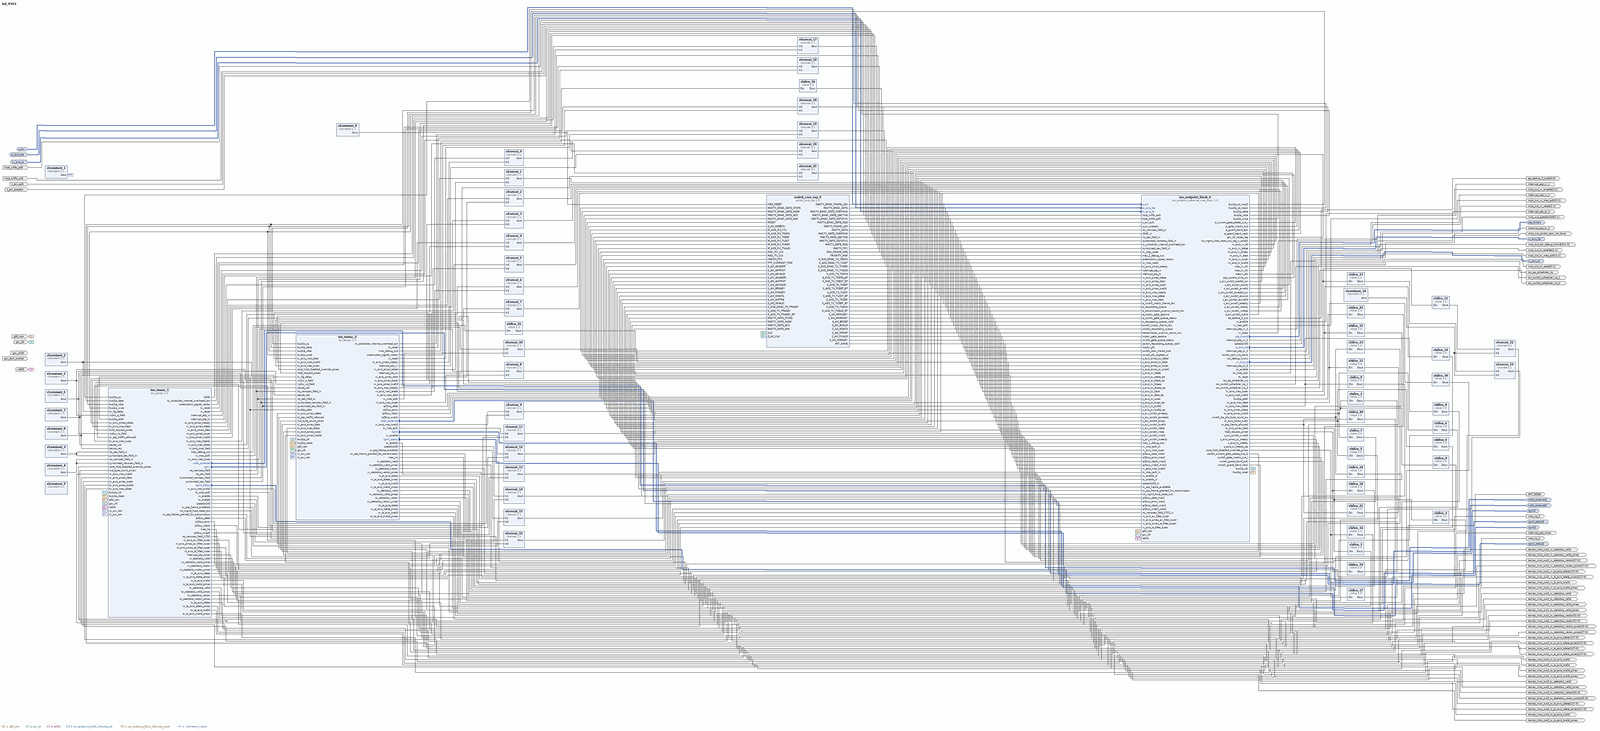
[diagram p0: block diagram of the top level, whole]
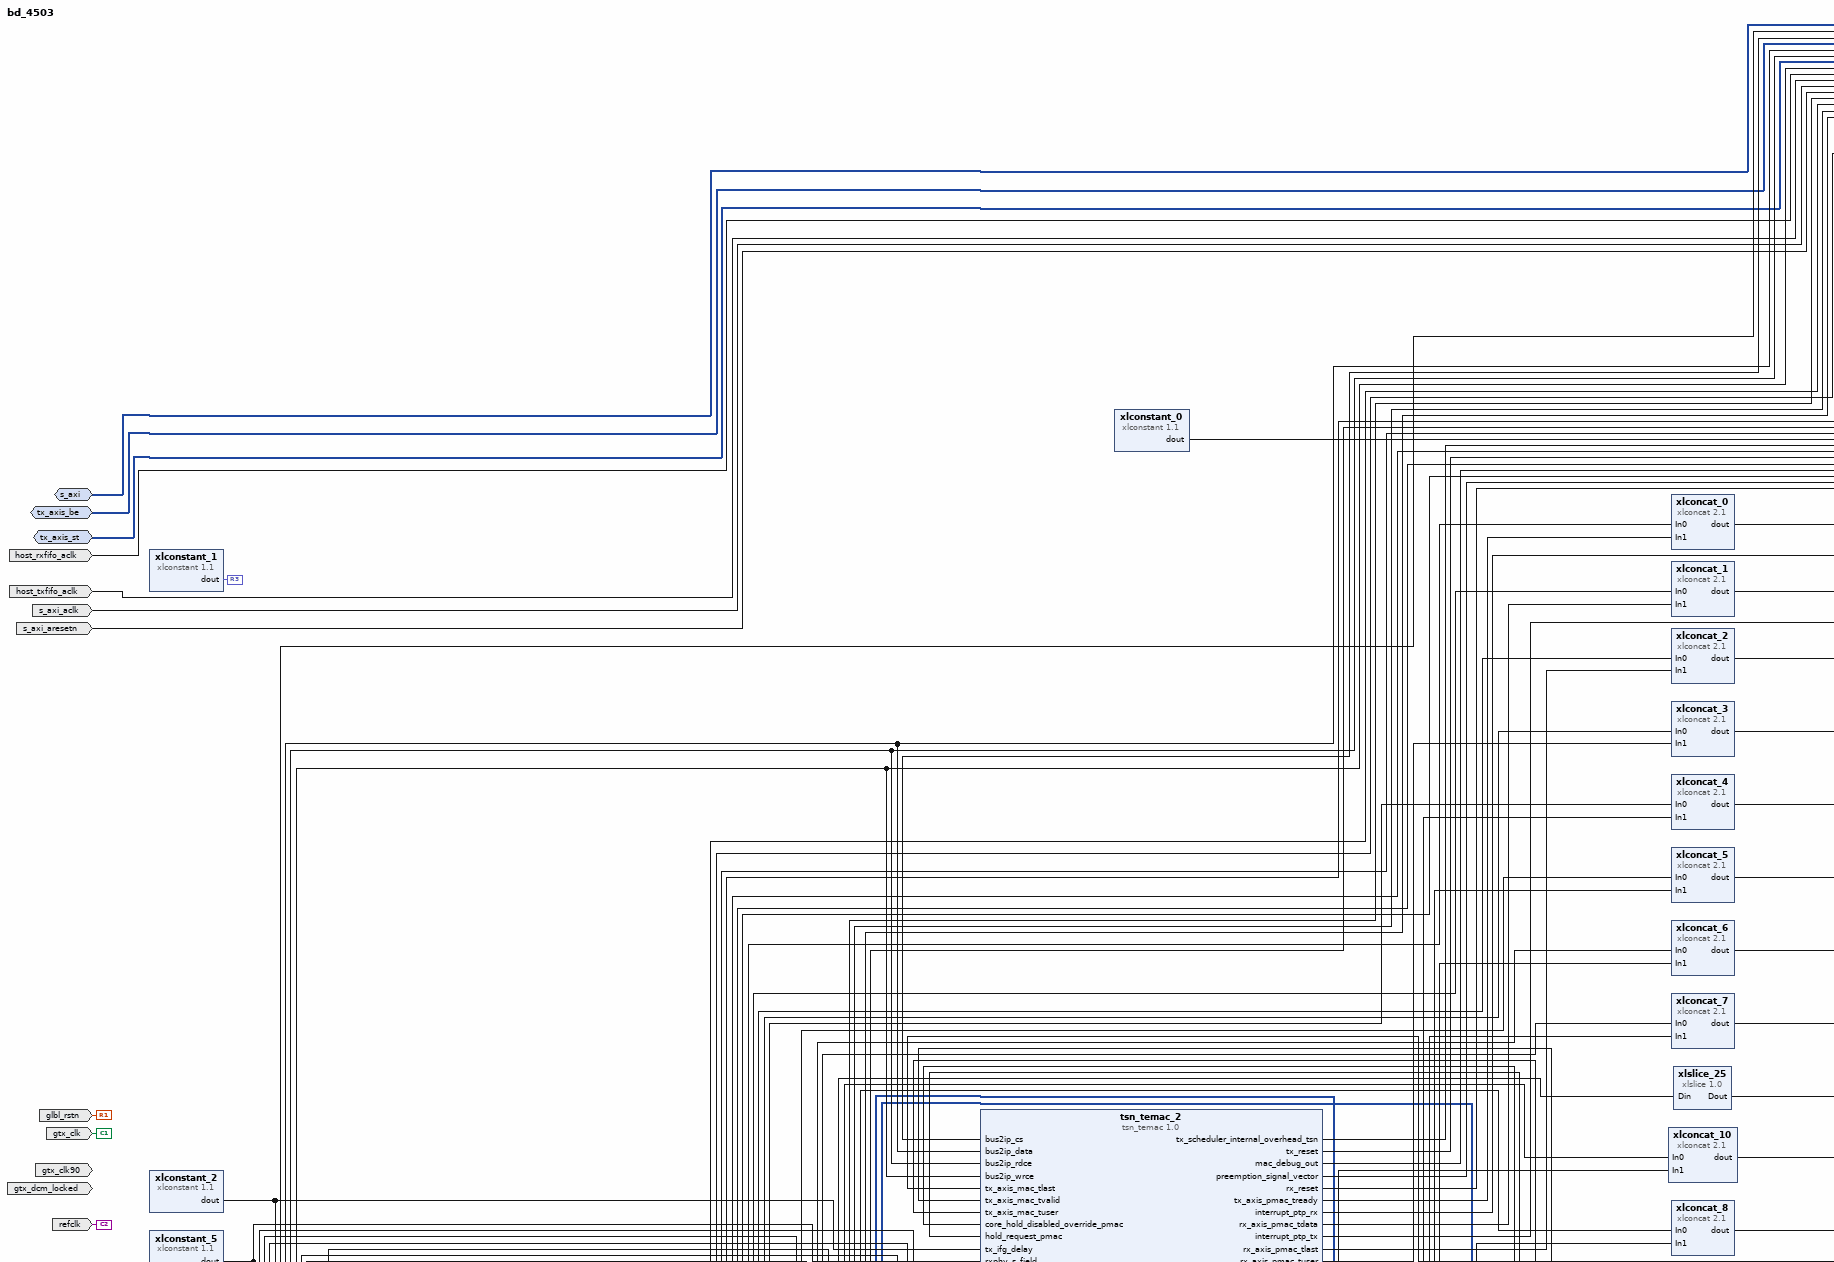
[diagram p1: block diagram of the top level, upper left part]
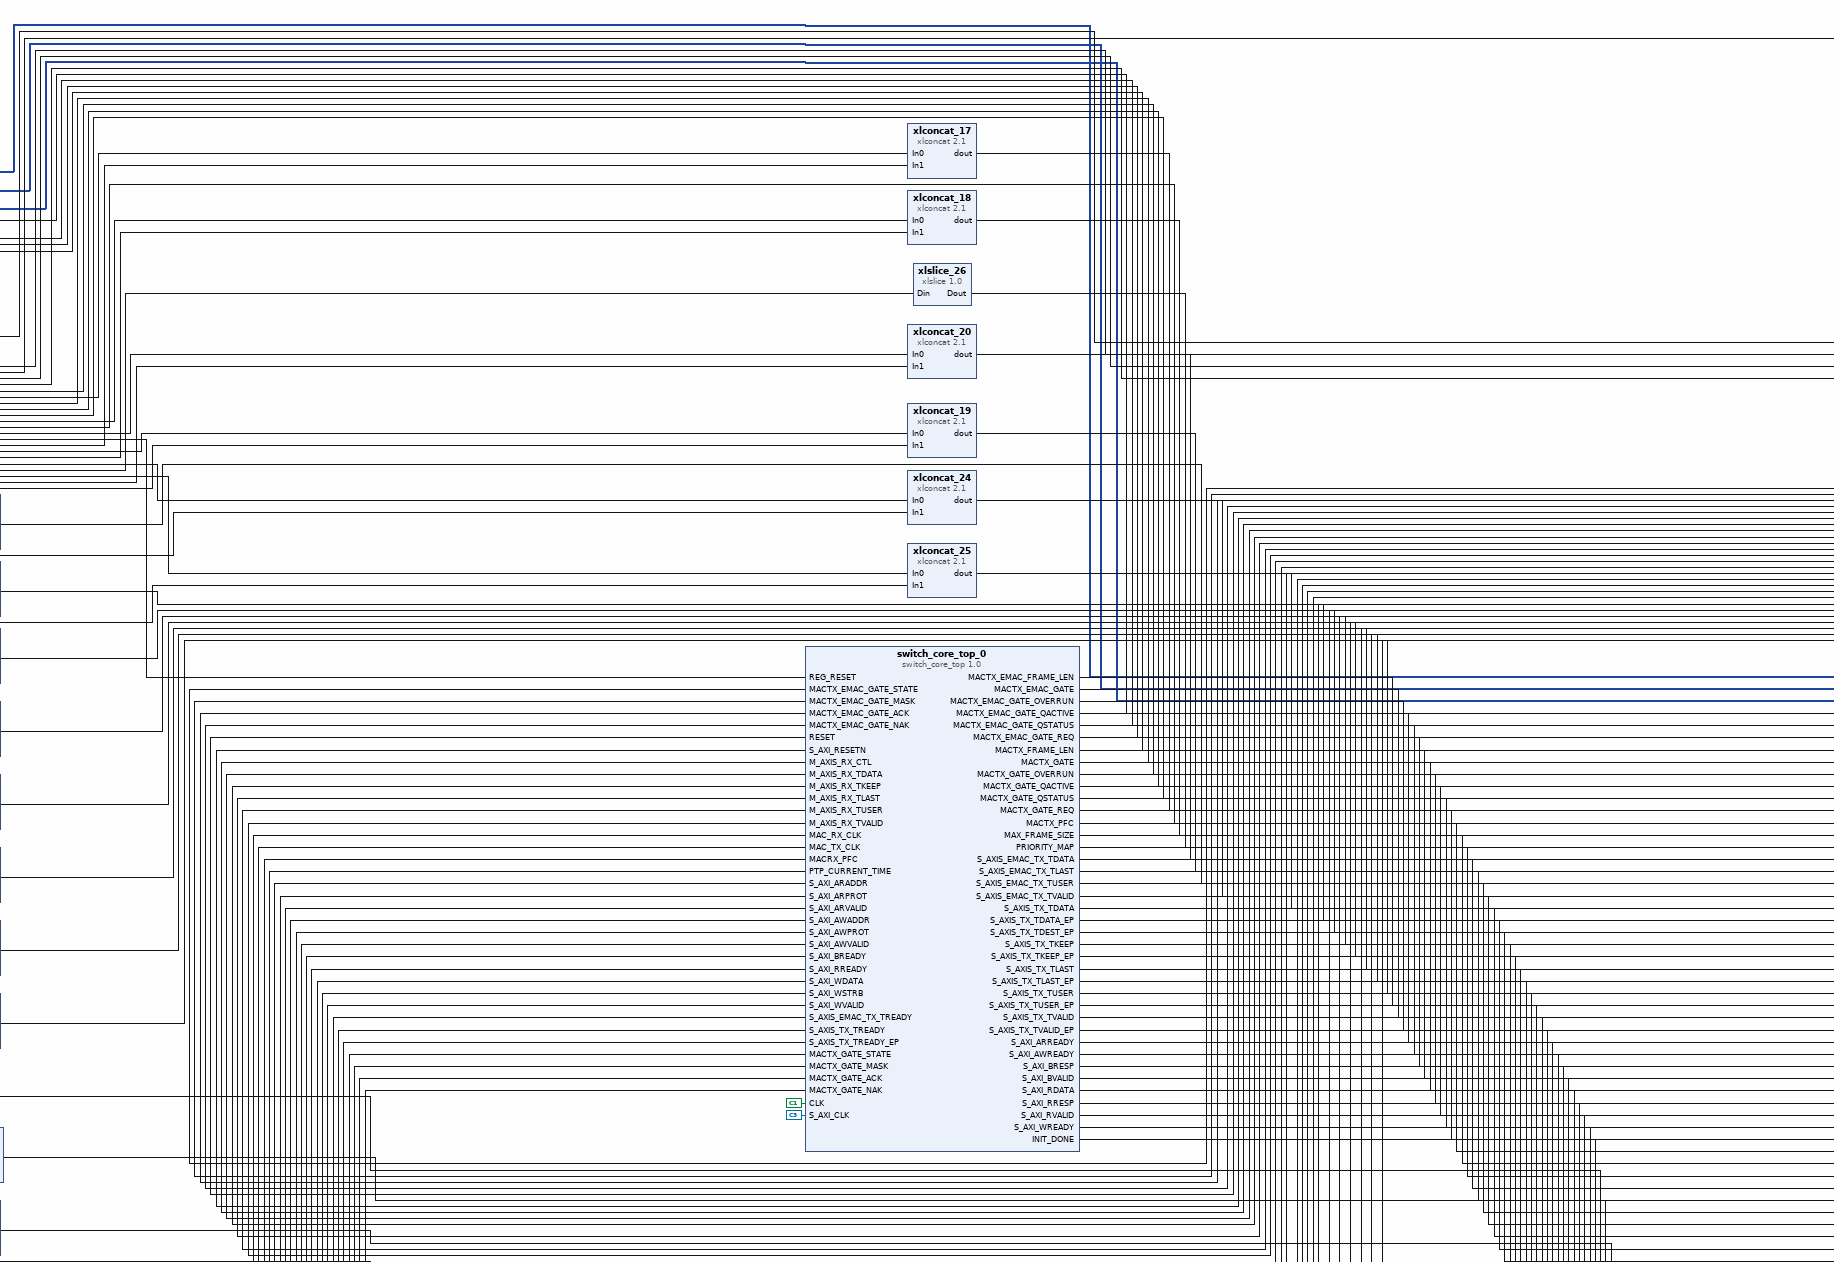
[diagram p2: block diagram of the top level, upper centre part]
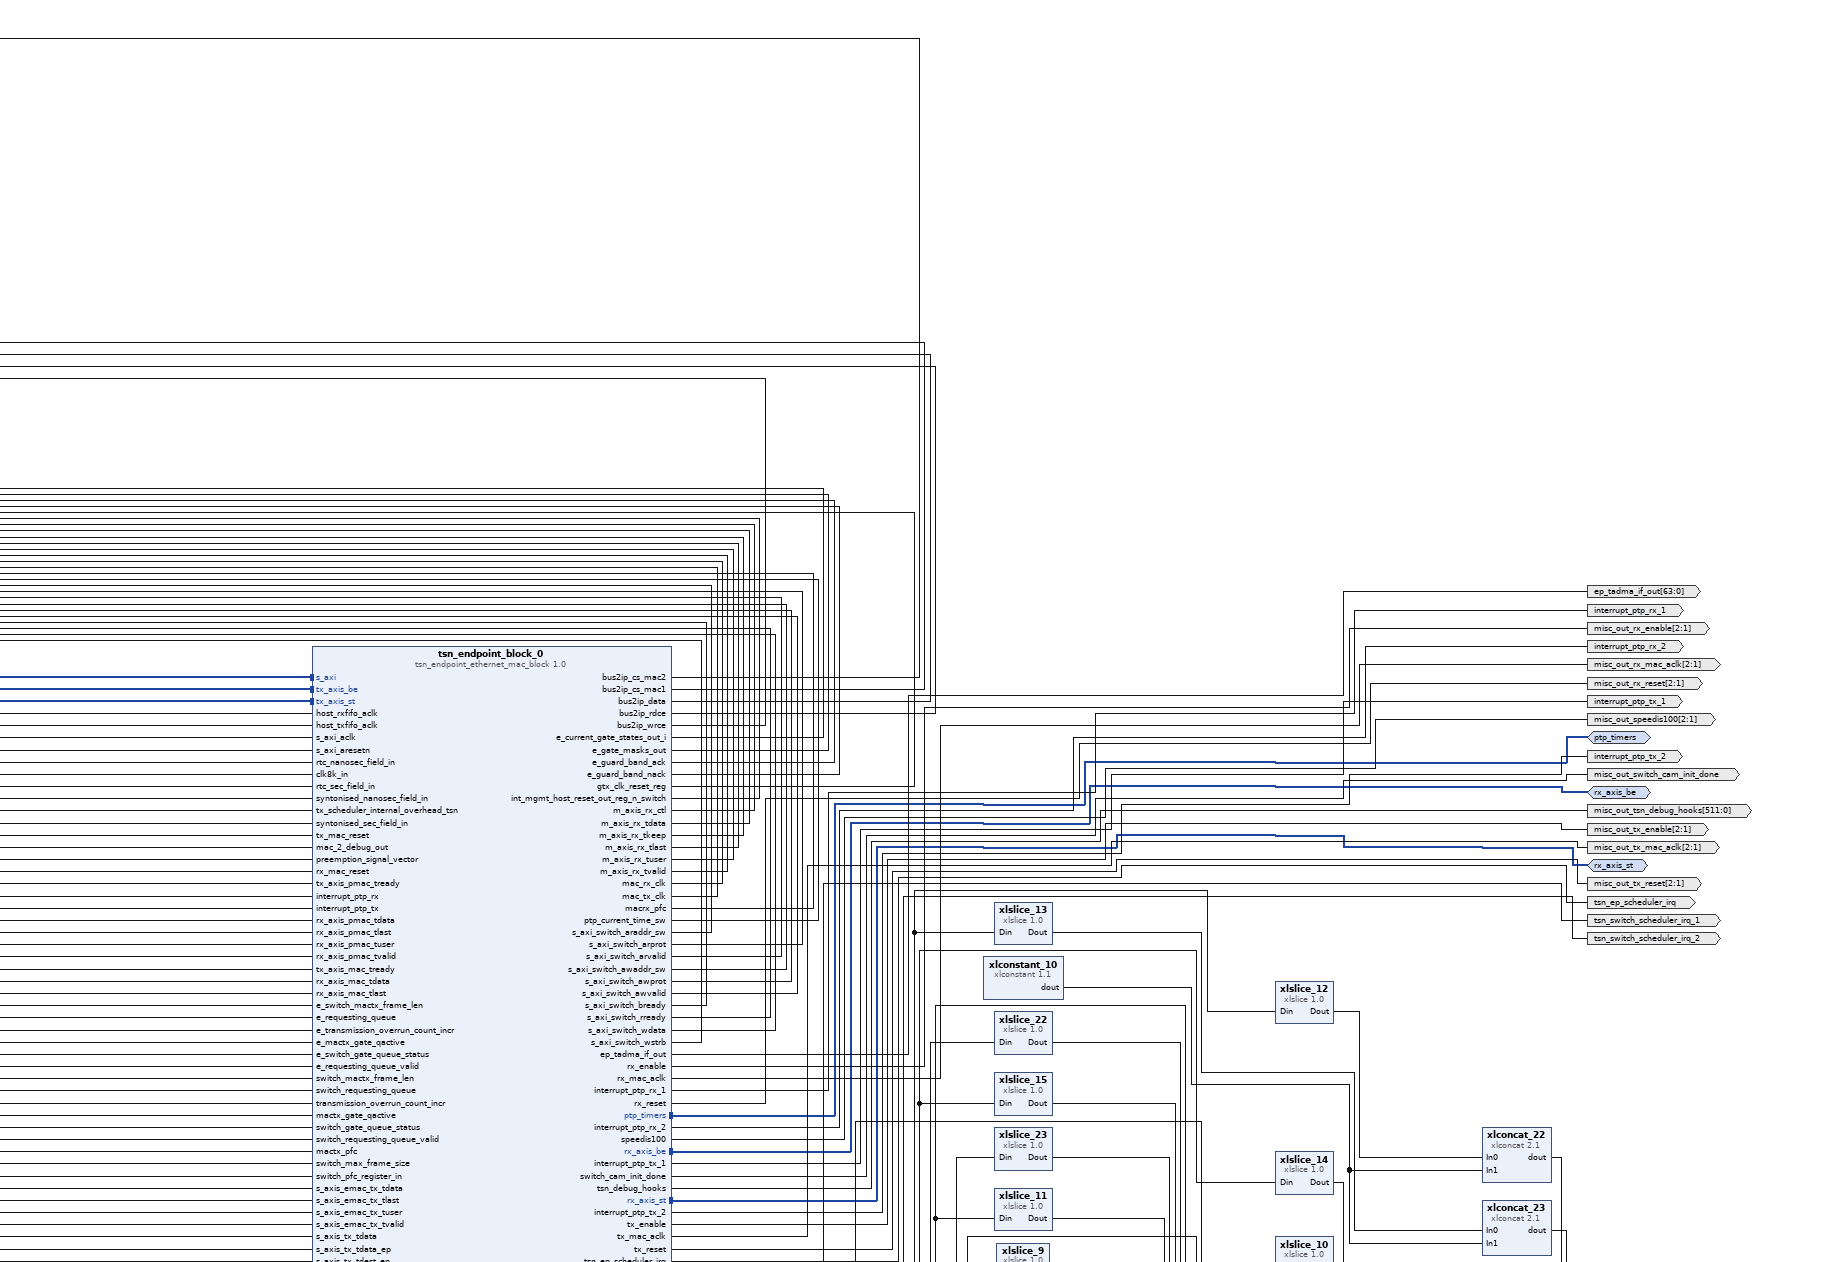
[diagram p3: block diagram of the top level, upper right part]
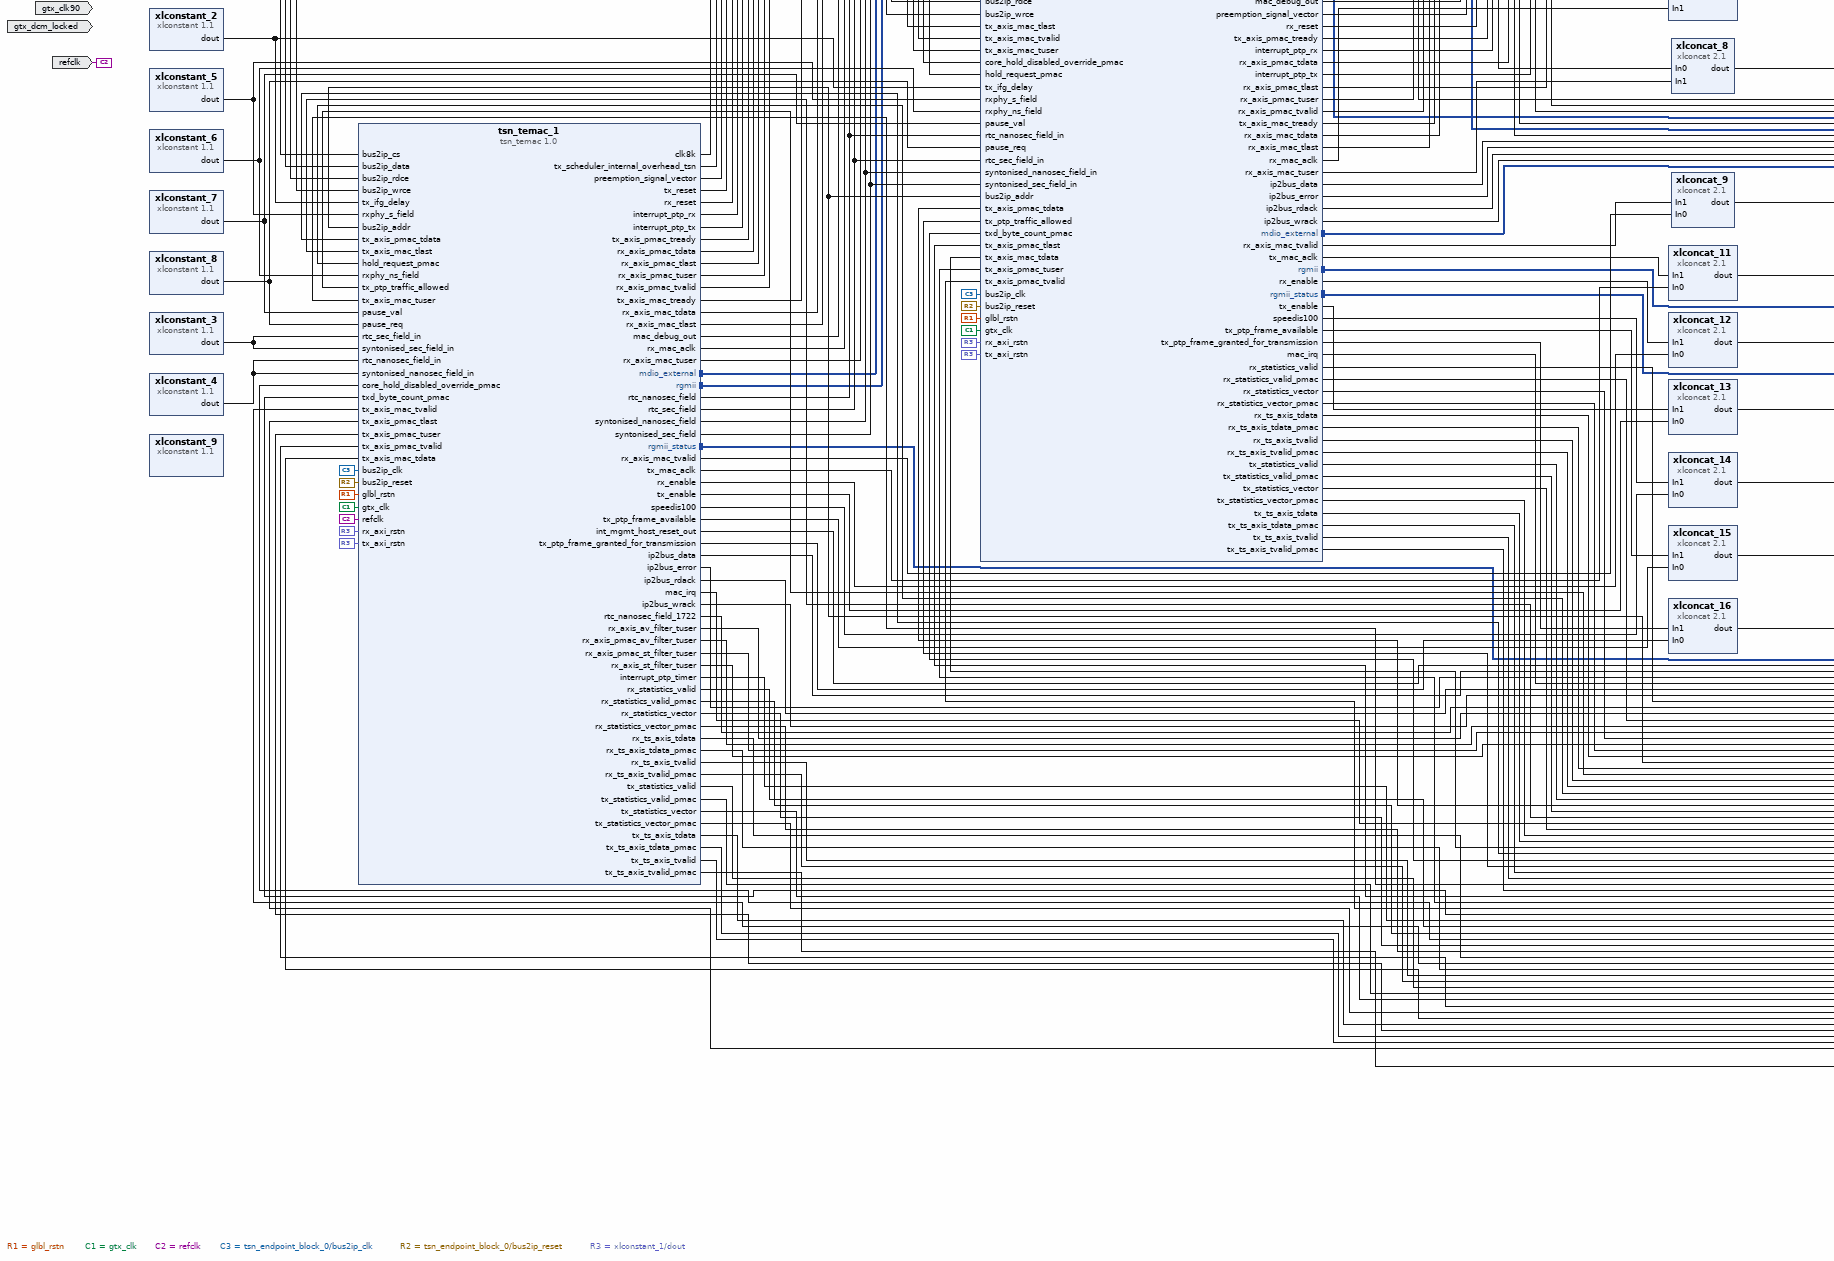
[diagram p4: block diagram of the top level, lower left part]
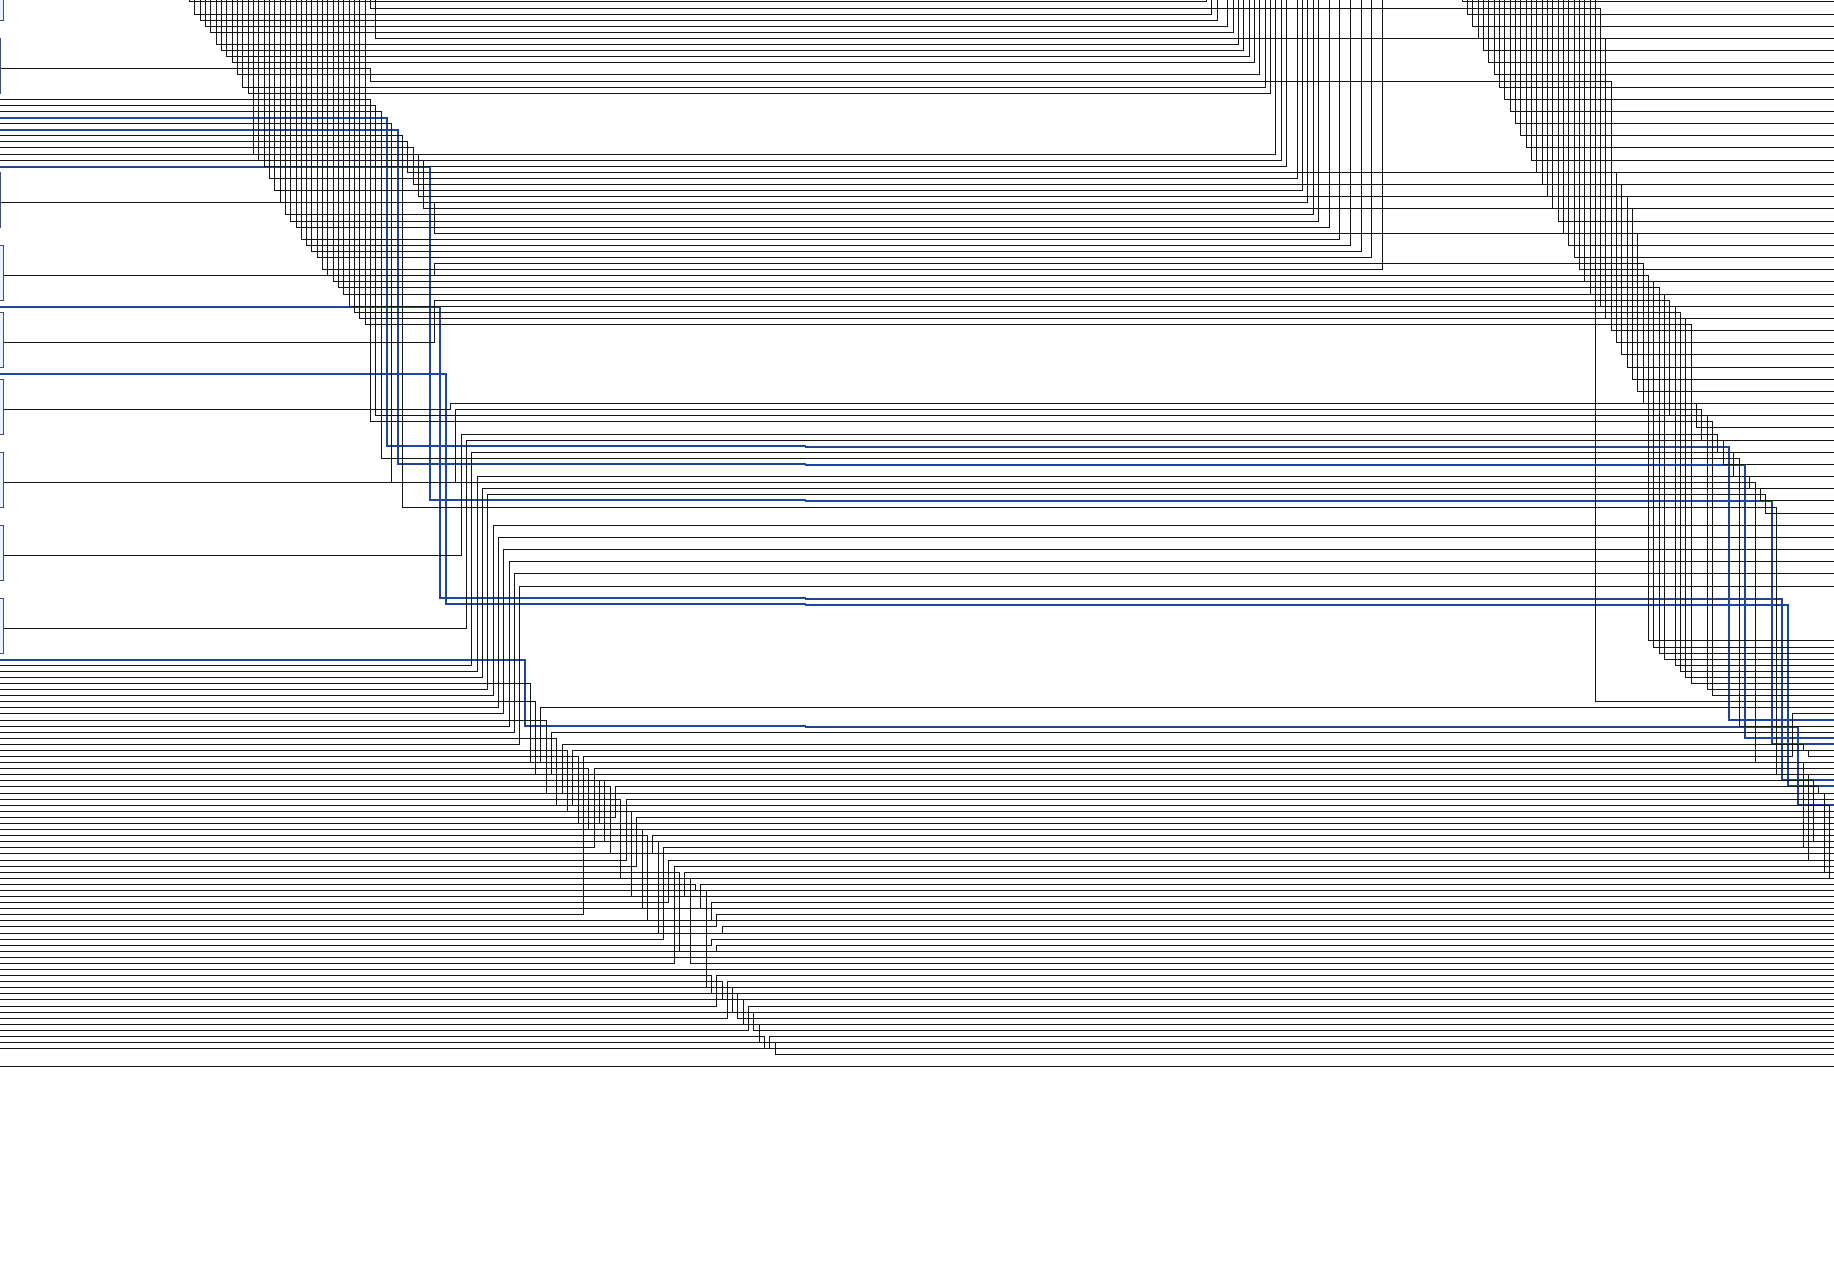
[diagram p5: block diagram of the top level, lower centre part]
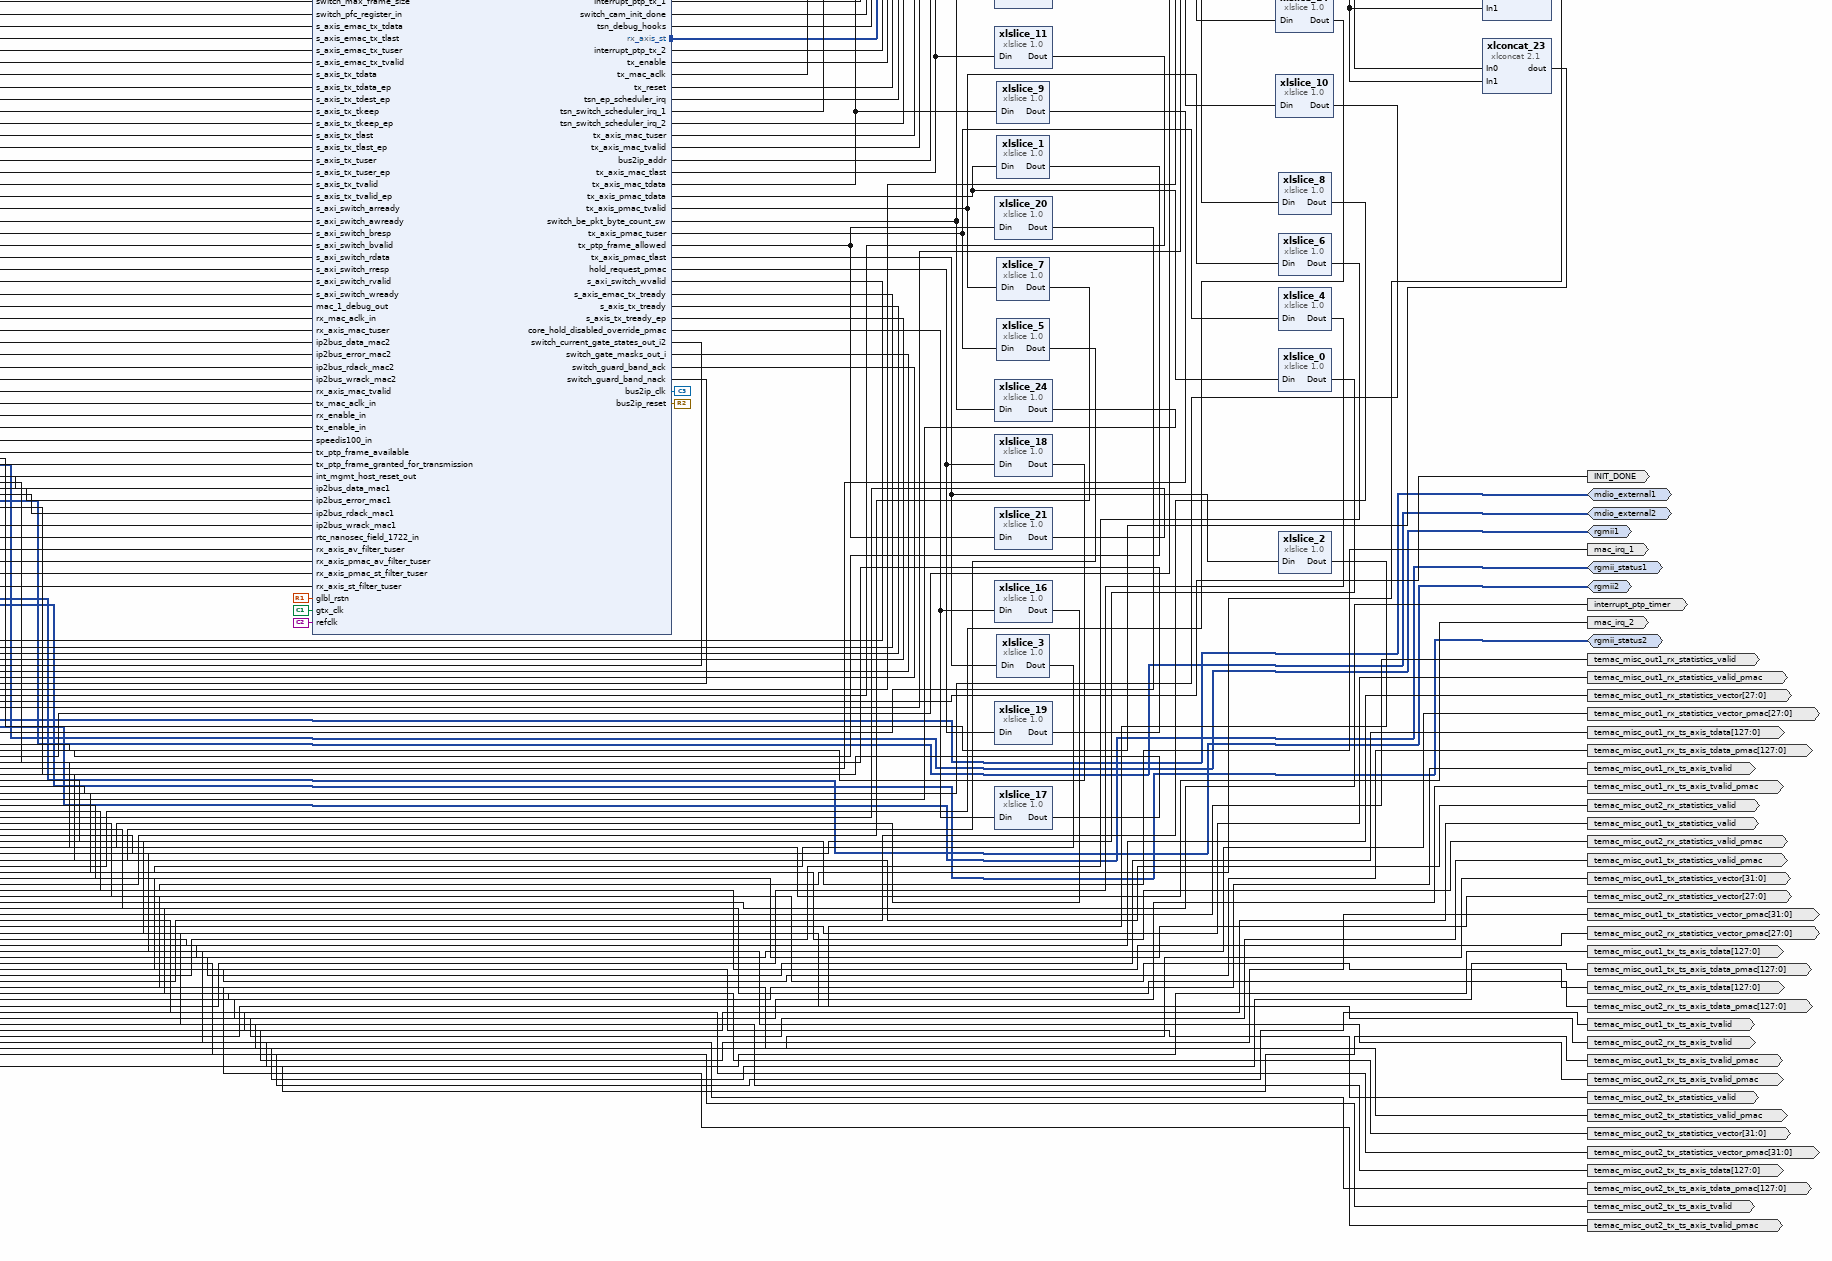
[diagram p6: block diagram of the top level, lower right part]
# Vivado block design bd_4503, xck26-sfvc784-2LV-c, Vivado 2023.2
create_bd_design bd_4503

create_bd_intf_port -mode Slave -vlnv xilinx.com:interface:aximm_rtl:1.0 s_axi
set_property -dict [list \
  CONFIG.ADDR_WIDTH 18 \
  CONFIG.ARUSER_WIDTH 0 \
  CONFIG.AWUSER_WIDTH 0 \
  CONFIG.BUSER_WIDTH 0 \
  CONFIG.DATA_WIDTH 32 \
  CONFIG.HAS_BRESP 1 \
  CONFIG.HAS_BURST 0 \
  CONFIG.HAS_CACHE 0 \
  CONFIG.HAS_LOCK 0 \
  CONFIG.HAS_PROT 0 \
  CONFIG.HAS_QOS 0 \
  CONFIG.HAS_REGION 0 \
  CONFIG.HAS_RRESP 1 \
  CONFIG.HAS_WSTRB 0 \
  CONFIG.ID_WIDTH 0 \
  CONFIG.MAX_BURST_LENGTH 1 \
  CONFIG.NUM_READ_OUTSTANDING 1 \
  CONFIG.NUM_READ_THREADS 1 \
  CONFIG.NUM_WRITE_OUTSTANDING 1 \
  CONFIG.NUM_WRITE_THREADS 1 \
  CONFIG.PROTOCOL AXI4LITE \
  CONFIG.READ_WRITE_MODE READ_WRITE \
  CONFIG.RUSER_BITS_PER_BYTE 0 \
  CONFIG.RUSER_WIDTH 0 \
  CONFIG.SUPPORTS_NARROW_BURST 0 \
  CONFIG.WUSER_BITS_PER_BYTE 0 \
  CONFIG.WUSER_WIDTH 0 \
] [get_bd_intf_ports s_axi]
create_bd_intf_port -mode Slave -vlnv xilinx.com:interface:axis_rtl:1.0 tx_axis_st
set_property -dict [list \
  CONFIG.HAS_TKEEP 1 \
  CONFIG.HAS_TLAST 1 \
  CONFIG.HAS_TREADY 1 \
  CONFIG.HAS_TSTRB 0 \
  CONFIG.LAYERED_METADATA undef \
  CONFIG.TDATA_NUM_BYTES 4 \
  CONFIG.TDEST_WIDTH 0 \
  CONFIG.TID_WIDTH 0 \
  CONFIG.TUSER_WIDTH 0 \
] [get_bd_intf_ports tx_axis_st]
create_bd_intf_port -mode Slave -vlnv xilinx.com:interface:axis_rtl:1.0 tx_axis_be
set_property -dict [list \
  CONFIG.HAS_TKEEP 1 \
  CONFIG.HAS_TLAST 1 \
  CONFIG.HAS_TREADY 1 \
  CONFIG.HAS_TSTRB 0 \
  CONFIG.LAYERED_METADATA undef \
  CONFIG.TDATA_NUM_BYTES 4 \
  CONFIG.TDEST_WIDTH 0 \
  CONFIG.TID_WIDTH 0 \
  CONFIG.TUSER_WIDTH 0 \
] [get_bd_intf_ports tx_axis_be]
create_bd_intf_port -mode Master -vlnv xilinx.com:interface:axis_rtl:1.0 rx_axis_st
create_bd_intf_port -mode Master -vlnv xilinx.com:interface:axis_rtl:1.0 rx_axis_be
create_bd_intf_port -mode Master -vlnv xilinx.com:display_tsn_temac:ptp_timers_rtl:1.0 ptp_timers
create_bd_intf_port -mode Master -vlnv xilinx.com:interface:rgmii_rtl:1.0 rgmii1
create_bd_intf_port -mode Master -vlnv xilinx.com:interface:rgmii_rtl:1.0 rgmii2
create_bd_intf_port -mode Master -vlnv xilinx.com:display_tri_mode_ethernet_mac:rgmii_status_rtl:1.0 rgmii_status1
create_bd_intf_port -mode Master -vlnv xilinx.com:display_tri_mode_ethernet_mac:rgmii_status_rtl:1.0 rgmii_status2
create_bd_intf_port -mode Master -vlnv xilinx.com:interface:mdio_io:1.0 mdio_external1
create_bd_intf_port -mode Master -vlnv xilinx.com:interface:mdio_io:1.0 mdio_external2
create_bd_port -dir I -type clk host_txfifo_aclk
create_bd_port -dir I -type clk host_rxfifo_aclk
create_bd_port -dir I -type clk s_axi_aclk
create_bd_port -dir I -type clk gtx_clk
create_bd_port -dir I -type clk gtx_clk90
create_bd_port -dir I -type clk refclk
set_property -dict {CONFIG.FREQ_HZ 300000000} [get_bd_ports refclk]
create_bd_port -dir I -type rst glbl_rstn
create_bd_port -dir I gtx_dcm_locked
create_bd_port -dir O -type intr interrupt_ptp_rx_1
set_property -dict {CONFIG.SENSITIVITY LEVEL_HIGH} [get_bd_ports interrupt_ptp_rx_1]
create_bd_port -dir O -type intr interrupt_ptp_tx_1
set_property -dict {CONFIG.SENSITIVITY LEVEL_HIGH} [get_bd_ports interrupt_ptp_tx_1]
create_bd_port -dir O -type intr mac_irq_1
set_property -dict {CONFIG.SENSITIVITY LEVEL_HIGH} [get_bd_ports mac_irq_1]
create_bd_port -dir I -type rst s_axi_aresetn
set_property -dict {CONFIG.POLARITY ACTIVE_LOW} [get_bd_ports s_axi_aresetn]
create_bd_port -dir O -type intr tsn_ep_scheduler_irq
set_property -dict {CONFIG.SENSITIVITY LEVEL_HIGH} [get_bd_ports tsn_ep_scheduler_irq]
create_bd_port -dir O -type intr interrupt_ptp_timer
create_bd_port -dir O -type intr interrupt_ptp_rx_2
set_property -dict {CONFIG.SENSITIVITY LEVEL_HIGH} [get_bd_ports interrupt_ptp_rx_2]
create_bd_port -dir O -type intr interrupt_ptp_tx_2
set_property -dict {CONFIG.SENSITIVITY LEVEL_HIGH} [get_bd_ports interrupt_ptp_tx_2]
create_bd_port -dir O -type intr mac_irq_2
set_property -dict {CONFIG.SENSITIVITY LEVEL_HIGH} [get_bd_ports mac_irq_2]
create_bd_port -dir O -type intr tsn_switch_scheduler_irq_1
set_property -dict {CONFIG.SENSITIVITY LEVEL_HIGH} [get_bd_ports tsn_switch_scheduler_irq_1]
create_bd_port -dir O -type intr tsn_switch_scheduler_irq_2
set_property -dict {CONFIG.SENSITIVITY LEVEL_HIGH} [get_bd_ports tsn_switch_scheduler_irq_2]
create_bd_port -dir O INIT_DONE
create_bd_port -dir O -from 63 -to 0 ep_tadma_if_out
create_bd_port -dir O -from 2 -to 1 misc_out_rx_enable
create_bd_port -dir O -from 2 -to 1 misc_out_tx_enable
create_bd_port -dir O -from 2 -to 1 misc_out_rx_mac_aclk
create_bd_port -dir O -from 2 -to 1 misc_out_rx_reset
create_bd_port -dir O -from 2 -to 1 misc_out_tx_mac_aclk
create_bd_port -dir O -from 2 -to 1 misc_out_tx_reset
create_bd_port -dir O -from 511 -to 0 misc_out_tsn_debug_hooks
create_bd_port -dir O -from 2 -to 1 misc_out_speedis100
create_bd_port -dir O misc_out_switch_cam_init_done
create_bd_port -dir O temac_misc_out1_tx_ts_axis_tvalid
create_bd_port -dir O -from 127 -to 0 temac_misc_out1_tx_ts_axis_tdata
create_bd_port -dir O temac_misc_out1_rx_ts_axis_tvalid
create_bd_port -dir O -from 127 -to 0 temac_misc_out1_rx_ts_axis_tdata
create_bd_port -dir O -from 27 -to 0 temac_misc_out1_rx_statistics_vector
create_bd_port -dir O temac_misc_out1_rx_statistics_valid
create_bd_port -dir O -from 31 -to 0 temac_misc_out1_tx_statistics_vector
create_bd_port -dir O temac_misc_out1_tx_statistics_valid
create_bd_port -dir O -from 27 -to 0 temac_misc_out1_rx_statistics_vector_pmac
create_bd_port -dir O temac_misc_out1_rx_statistics_valid_pmac
create_bd_port -dir O -from 31 -to 0 temac_misc_out1_tx_statistics_vector_pmac
create_bd_port -dir O temac_misc_out1_tx_statistics_valid_pmac
create_bd_port -dir O temac_misc_out1_rx_ts_axis_tvalid_pmac
create_bd_port -dir O temac_misc_out1_tx_ts_axis_tvalid_pmac
create_bd_port -dir O -from 127 -to 0 temac_misc_out1_rx_ts_axis_tdata_pmac
create_bd_port -dir O -from 127 -to 0 temac_misc_out1_tx_ts_axis_tdata_pmac
create_bd_port -dir O temac_misc_out2_tx_ts_axis_tvalid
create_bd_port -dir O -from 127 -to 0 temac_misc_out2_tx_ts_axis_tdata
create_bd_port -dir O temac_misc_out2_rx_ts_axis_tvalid
create_bd_port -dir O -from 127 -to 0 temac_misc_out2_rx_ts_axis_tdata
create_bd_port -dir O -from 27 -to 0 temac_misc_out2_rx_statistics_vector
create_bd_port -dir O temac_misc_out2_rx_statistics_valid
create_bd_port -dir O -from 31 -to 0 temac_misc_out2_tx_statistics_vector
create_bd_port -dir O temac_misc_out2_tx_statistics_valid
create_bd_port -dir O -from 27 -to 0 temac_misc_out2_rx_statistics_vector_pmac
create_bd_port -dir O temac_misc_out2_rx_statistics_valid_pmac
create_bd_port -dir O -from 31 -to 0 temac_misc_out2_tx_statistics_vector_pmac
create_bd_port -dir O temac_misc_out2_tx_statistics_valid_pmac
create_bd_port -dir O temac_misc_out2_rx_ts_axis_tvalid_pmac
create_bd_port -dir O temac_misc_out2_tx_ts_axis_tvalid_pmac
create_bd_port -dir O -from 127 -to 0 temac_misc_out2_rx_ts_axis_tdata_pmac
create_bd_port -dir O -from 127 -to 0 temac_misc_out2_tx_ts_axis_tdata_pmac

create_bd_cell -type ip -vlnv xilinx.com:ip:tsn_endpoint_ethernet_mac_block:1.0 tsn_endpoint_block_0
set_property -dict [list \
  CONFIG.ADDR_TRANSLATION_TYPE false \
  CONFIG.BE_MAX_FRM_SIZE_SUPPORTED 2000 \
  CONFIG.ENABLE_EP_TADMA_INTERFACE true \
  CONFIG.EN_1588_PTP_V1_SUPPORT false \
  CONFIG.EN_ADV_OPTIONS true \
  CONFIG.EN_COMMON_STATS false \
  CONFIG.EN_DEBUG_HOOKS true \
  CONFIG.EN_EP_PKT_SWITCH false \
  CONFIG.EN_FMC_CARD true \
  CONFIG.EN_FRAME_PREEMPTION_SUPPORT true \
  CONFIG.EN_FRAME_PREEMPTION_SUPPORT_MAC_2 true \
  CONFIG.EN_FRER true \
  CONFIG.EN_HW_ADDR_LEARNING true \
  CONFIG.EN_MDIO_INTF true \
  CONFIG.EN_MDIO_IO_BUF true \
  CONFIG.EN_PER_PRIQ_CNFGS false \
  CONFIG.EN_PREEMPTION false \
  CONFIG.EN_PSFP true \
  CONFIG.EN_RX_CUSTOM_TIMESTAMP true \
  CONFIG.EN_STFWD_MODE_EP false \
  CONFIG.EN_SWITCH_CASCADE false \
  CONFIG.EN_TX_CUSTOM_TIMESTAMP true \
  CONFIG.EP2MAC_P0Q_DEPTH 512 \
  CONFIG.EP2MAC_P1Q_DEPTH 512 \
  CONFIG.EP2MAC_P2Q_DEPTH 512 \
  CONFIG.Int_Clk_Src User_Clk2 \
  CONFIG.MAC2MAC_P0Q_DEPTH 1024 \
  CONFIG.MAC2MAC_P1Q_DEPTH 1024 \
  CONFIG.MAC2MAC_P2Q_DEPTH 1024 \
  CONFIG.MAC_Speed Tri_speed \
  CONFIG.MAX_LEARNING_ENTRIES 1920 \
  CONFIG.MAX_PACKET_SIZE 2000 \
  CONFIG.NUM_PTP_RX_MSG 16 \
  CONFIG.NUM_PTP_V1_RX_MSG 16 \
  CONFIG.PHYSICAL_INTERFACE RGMII \
  CONFIG.PTP_BRAM_PARTITION_SIZE 256 \
  CONFIG.PTP_V1_BRAM_PARTITION_SIZE 256 \
  CONFIG.RESERVED_QUEUE 2 \
  CONFIG.RES_MAX_FRM_SIZE_SUPPORTED 2000 \
  CONFIG.STATISTICS_COUNTERS true \
  CONFIG.STATISTICS_RESET true \
  CONFIG.STATISTICS_WIDTH 64bit \
  CONFIG.STORE_AND_FORWARD 1 \
  CONFIG.ST_MAX_FRM_SIZE_SUPPORTED 2000 \
  CONFIG.SYNTONIZED_TIMESTAMPS 0 \
  CONFIG.TSN_EP_MASTER_SLAVE Master \
  CONFIG.TSN_EP_Switch 1 \
  CONFIG.TSN_IPI_STREAM_CONNECT {tx_axis_st ta_dma_0 rx_axis_st axis_switch_0 tx_axis_be axi_mcdma_0 rx_axis_be axis_switch_0} \
  CONFIG.TimeStamp_Support_1588 1_step_tod \
  CONFIG.USE_HARD_FIFO 0 \
] [get_bd_cells tsn_endpoint_block_0]
create_bd_cell -type ip -vlnv xilinx.com:ip:tsn_temac:1.0 tsn_temac_1
set_property -dict [list \
  CONFIG.ADDR_TRANSLATION_TYPE false \
  CONFIG.BESTEFFORT_QUEUE 1 \
  CONFIG.Disable_PTP false \
  CONFIG.EN_1588_PTP_V1_SUPPORT false \
  CONFIG.EN_CB_RSVD_BYTES true \
  CONFIG.EN_DEBUG_HOOKS true \
  CONFIG.EN_EP_PKT_SWITCH false \
  CONFIG.EN_EP_PORT_EXTN false \
  CONFIG.EN_FMC_CARD true \
  CONFIG.EN_FRAME_PREEMPTION_SUPPORT true \
  CONFIG.EN_FRER true \
  CONFIG.EN_HW_ADDR_LEARNING true \
  CONFIG.EN_PER_PRIQ_CNFGS false \
  CONFIG.EN_PSFP true \
  CONFIG.EN_RX_CUSTOM_TIMESTAMP true \
  CONFIG.EN_SCHEDULED_PREEMPTION true \
  CONFIG.EN_TX_CUSTOM_TIMESTAMP true \
  CONFIG.Enable_1588 true \
  CONFIG.Enable_MDIO true \
  CONFIG.Frame_Filter false \
  CONFIG.Int_Clk_Src User_Clk2 \
  CONFIG.MAC_Speed Tri_speed \
  CONFIG.Make_MDIO_External true \
  CONFIG.NUM_PRIORITIES 2 \
  CONFIG.NUM_PTP_RX_MSG 16 \
  CONFIG.NUM_PTP_V1_RX_MSG 16 \
  CONFIG.Number_of_Table_Entries 0 \
  CONFIG.PTP_BRAM_PARTITION_SIZE 256 \
  CONFIG.PTP_V1_BRAM_PARTITION_SIZE 256 \
  CONFIG.Physical_Interface RGMII \
  CONFIG.RESERVED_QUEUE 2 \
  CONFIG.SCHEDULED_QUEUE 0 \
  CONFIG.SYNTONIZED_TIMESTAMPS 0 \
  CONFIG.Statistics_Counters true \
  CONFIG.Statistics_Reset true \
  CONFIG.Statistics_Width 64bit \
  CONFIG.SupportLevel 1 \
  CONFIG.TSN_CHANGE_ENABLE 1 \
  CONFIG.TSN_EP_EVAL 0 \
  CONFIG.TSN_EP_ONLY 0 \
  CONFIG.TSN_RTC_ENABLE 1 \
  CONFIG.TimeStamp_Support_1588 1_Step \
  CONFIG.Timer_Format Time_of_day \
  CONFIG.USE_HARD_FIFO 0 \
] [get_bd_cells tsn_temac_1]
create_bd_cell -type ip -vlnv xilinx.com:ip:tsn_temac:1.0 tsn_temac_2
set_property -dict [list \
  CONFIG.ADDR_TRANSLATION_TYPE false \
  CONFIG.BESTEFFORT_QUEUE 1 \
  CONFIG.Disable_PTP false \
  CONFIG.EN_1588_PTP_V1_SUPPORT false \
  CONFIG.EN_CB_RSVD_BYTES true \
  CONFIG.EN_DEBUG_HOOKS true \
  CONFIG.EN_FMC_CARD true \
  CONFIG.EN_FRAME_PREEMPTION_SUPPORT true \
  CONFIG.EN_FRER true \
  CONFIG.EN_HW_ADDR_LEARNING true \
  CONFIG.EN_PER_PRIQ_CNFGS false \
  CONFIG.EN_PSFP true \
  CONFIG.EN_RX_CUSTOM_TIMESTAMP true \
  CONFIG.EN_SCHEDULED_PREEMPTION true \
  CONFIG.EN_TX_CUSTOM_TIMESTAMP true \
  CONFIG.Enable_1588 true \
  CONFIG.Enable_MDIO true \
  CONFIG.Frame_Filter false \
  CONFIG.Int_Clk_Src User_Clk2 \
  CONFIG.MAC_Speed Tri_speed \
  CONFIG.Make_MDIO_External true \
  CONFIG.NUM_PRIORITIES 2 \
  CONFIG.NUM_PTP_RX_MSG 16 \
  CONFIG.NUM_PTP_V1_RX_MSG 16 \
  CONFIG.Number_of_Table_Entries 0 \
  CONFIG.PTP_BRAM_PARTITION_SIZE 256 \
  CONFIG.PTP_V1_BRAM_PARTITION_SIZE 256 \
  CONFIG.Physical_Interface RGMII \
  CONFIG.RESERVED_QUEUE 2 \
  CONFIG.SCHEDULED_QUEUE 0 \
  CONFIG.SYNTONIZED_TIMESTAMPS 0 \
  CONFIG.Statistics_Counters true \
  CONFIG.Statistics_Reset true \
  CONFIG.Statistics_Width 64bit \
  CONFIG.SupportLevel 0 \
  CONFIG.TSN_CHANGE_ENABLE 1 \
  CONFIG.TSN_EP_EVAL 0 \
  CONFIG.TSN_EP_ONLY 0 \
  CONFIG.TSN_RTC_ENABLE 0 \
  CONFIG.TimeStamp_Support_1588 1_Step \
  CONFIG.Timer_Format Time_of_day \
  CONFIG.USE_HARD_FIFO 0 \
] [get_bd_cells tsn_temac_2]
create_bd_cell -type ip -vlnv xilinx.com:ip:switch_core_top:1.0 switch_core_top_0
set_property -dict [list \
  CONFIG.ADDR_TRANSLATION_TYPE false \
  CONFIG.AGING_TIME_BIT 27 \
  CONFIG.AGING_WAIT_CLKS 512 \
  CONFIG.C_MAX_STREAM_GATES 256 \
  CONFIG.EN_CB_RSVD_BYTES true \
  CONFIG.EN_COMMON_STATS false \
  CONFIG.EN_EP_EXTN_STATS false \
  CONFIG.EN_EP_PKT_SWITCH false \
  CONFIG.EN_EP_PORT_EXTN false \
  CONFIG.EN_FRER true \
  CONFIG.EN_HW_ADDR_LEARNING true \
  CONFIG.EN_MAC_PREEMPTION 6 \
  CONFIG.EN_PERVLAN_AGING_TIME 1 \
  CONFIG.EN_PER_PRIQ_CNFGS false \
  CONFIG.EN_PREEMPTION false \
  CONFIG.EN_PSFP true \
  CONFIG.EN_STFWD_MODE_EP false \
  CONFIG.EN_SWITCH_CASCADE false \
  CONFIG.EP2MAC_P0Q_DEPTH 512 \
  CONFIG.EP2MAC_P1Q_DEPTH 512 \
  CONFIG.EP2MAC_P2Q_DEPTH 512 \
  CONFIG.MAC2MAC_P0Q_DEPTH 1024 \
  CONFIG.MAC2MAC_P1Q_DEPTH 1024 \
  CONFIG.MAC2MAC_P2Q_DEPTH 1024 \
  CONFIG.MAX_FRAME_SIZE_P0Q 2000 \
  CONFIG.MAX_FRAME_SIZE_P1Q 2000 \
  CONFIG.MAX_FRAME_SIZE_P2Q 2000 \
  CONFIG.MAX_LEARNING_ENTRIES 1920 \
  CONFIG.MAX_PACKET_SIZE 2000 \
  CONFIG.NUM_PRIORITIES 2 \
  CONFIG.STORE_AND_FORWARD 2 \
  CONFIG.USE_HARD_FIFO 0 \
  CONFIG.USE_ULTRA_RAM 1 \
] [get_bd_cells switch_core_top_0]
create_bd_cell -type ip -vlnv xilinx.com:ip:xlconcat:2.1 xlconcat_0
create_bd_cell -type ip -vlnv xilinx.com:ip:xlconcat:2.1 xlconcat_1
set_property -dict {CONFIG.IN0_WIDTH 8 CONFIG.IN1_WIDTH 8} [get_bd_cells xlconcat_1]
create_bd_cell -type ip -vlnv xilinx.com:ip:xlconcat:2.1 xlconcat_2
create_bd_cell -type ip -vlnv xilinx.com:ip:xlconcat:2.1 xlconcat_3
create_bd_cell -type ip -vlnv xilinx.com:ip:xlconcat:2.1 xlconcat_4
create_bd_cell -type ip -vlnv xilinx.com:ip:xlconcat:2.1 xlconcat_5
create_bd_cell -type ip -vlnv xilinx.com:ip:xlconcat:2.1 xlconcat_6
set_property -dict {CONFIG.IN0_WIDTH 8 CONFIG.IN1_WIDTH 8} [get_bd_cells xlconcat_6]
create_bd_cell -type ip -vlnv xilinx.com:ip:xlconcat:2.1 xlconcat_7
create_bd_cell -type ip -vlnv xilinx.com:ip:xlconcat:2.1 xlconcat_8
create_bd_cell -type ip -vlnv xilinx.com:ip:xlconcat:2.1 xlconcat_9
create_bd_cell -type ip -vlnv xilinx.com:ip:xlconcat:2.1 xlconcat_10
create_bd_cell -type ip -vlnv xilinx.com:ip:xlconcat:2.1 xlconcat_11
create_bd_cell -type ip -vlnv xilinx.com:ip:xlconcat:2.1 xlconcat_12
create_bd_cell -type ip -vlnv xilinx.com:ip:xlconcat:2.1 xlconcat_13
create_bd_cell -type ip -vlnv xilinx.com:ip:xlconcat:2.1 xlconcat_14
create_bd_cell -type ip -vlnv xilinx.com:ip:xlconcat:2.1 xlconcat_15
create_bd_cell -type ip -vlnv xilinx.com:ip:xlconcat:2.1 xlconcat_16
create_bd_cell -type ip -vlnv xilinx.com:ip:xlconcat:2.1 xlconcat_17
set_property -dict {CONFIG.IN0_WIDTH 32 CONFIG.IN1_WIDTH 32} [get_bd_cells xlconcat_17]
create_bd_cell -type ip -vlnv xilinx.com:ip:xlconcat:2.1 xlconcat_18
create_bd_cell -type ip -vlnv xilinx.com:ip:xlconcat:2.1 xlconcat_19
create_bd_cell -type ip -vlnv xilinx.com:ip:xlconcat:2.1 xlconcat_20
set_property -dict {CONFIG.IN0_WIDTH 512 CONFIG.IN1_WIDTH 512} [get_bd_cells xlconcat_20]
create_bd_cell -type ip -vlnv xilinx.com:ip:xlconcat:2.1 xlconcat_22
set_property -dict {CONFIG.IN0_WIDTH 1 CONFIG.IN1_WIDTH 127} [get_bd_cells xlconcat_22]
create_bd_cell -type ip -vlnv xilinx.com:ip:xlconcat:2.1 xlconcat_23
set_property -dict {CONFIG.IN0_WIDTH 1 CONFIG.IN1_WIDTH 127} [get_bd_cells xlconcat_23]
create_bd_cell -type ip -vlnv xilinx.com:ip:xlconcat:2.1 xlconcat_24
set_property -dict {CONFIG.IN0_WIDTH 1 CONFIG.IN1_WIDTH 1} [get_bd_cells xlconcat_24]
create_bd_cell -type ip -vlnv xilinx.com:ip:xlconcat:2.1 xlconcat_25
set_property -dict {CONFIG.IN0_WIDTH 1 CONFIG.IN1_WIDTH 1} [get_bd_cells xlconcat_25]
create_bd_cell -type ip -vlnv xilinx.com:ip:xlconstant:1.1 xlconstant_0
set_property -dict {CONFIG.CONST_VAL 0} [get_bd_cells xlconstant_0]
create_bd_cell -type ip -vlnv xilinx.com:ip:xlconstant:1.1 xlconstant_1
create_bd_cell -type ip -vlnv xilinx.com:ip:xlconstant:1.1 xlconstant_2
set_property -dict {CONFIG.CONST_VAL 12 CONFIG.CONST_WIDTH 8} [get_bd_cells xlconstant_2]
create_bd_cell -type ip -vlnv xilinx.com:ip:xlconstant:1.1 xlconstant_3
set_property -dict {CONFIG.CONST_VAL 0 CONFIG.CONST_WIDTH 48} [get_bd_cells xlconstant_3]
create_bd_cell -type ip -vlnv xilinx.com:ip:xlconstant:1.1 xlconstant_4
set_property -dict {CONFIG.CONST_VAL 0 CONFIG.CONST_WIDTH 32} [get_bd_cells xlconstant_4]
create_bd_cell -type ip -vlnv xilinx.com:ip:xlconstant:1.1 xlconstant_5
set_property -dict {CONFIG.CONST_VAL 0 CONFIG.CONST_WIDTH 48} [get_bd_cells xlconstant_5]
create_bd_cell -type ip -vlnv xilinx.com:ip:xlconstant:1.1 xlconstant_6
set_property -dict {CONFIG.CONST_VAL 0 CONFIG.CONST_WIDTH 32} [get_bd_cells xlconstant_6]
create_bd_cell -type ip -vlnv xilinx.com:ip:xlconstant:1.1 xlconstant_7
set_property -dict {CONFIG.CONST_VAL 0 CONFIG.CONST_WIDTH 16} [get_bd_cells xlconstant_7]
create_bd_cell -type ip -vlnv xilinx.com:ip:xlconstant:1.1 xlconstant_8
set_property -dict {CONFIG.CONST_VAL 0} [get_bd_cells xlconstant_8]
create_bd_cell -type ip -vlnv xilinx.com:ip:xlconstant:1.1 xlconstant_9
set_property -dict {CONFIG.CONST_VAL 1} [get_bd_cells xlconstant_9]
create_bd_cell -type ip -vlnv xilinx.com:ip:xlconstant:1.1 xlconstant_10
set_property -dict {CONFIG.CONST_VAL 0 CONFIG.CONST_WIDTH 127} [get_bd_cells xlconstant_10]
create_bd_cell -type ip -vlnv xilinx.com:ip:xlslice:1.0 xlslice_0
set_property -dict {CONFIG.DIN_FROM 7 CONFIG.DIN_TO 0 CONFIG.DIN_WIDTH 16 CONFIG.DOUT_WIDTH 8} [get_bd_cells xlslice_0]
create_bd_cell -type ip -vlnv xilinx.com:ip:xlslice:1.0 xlslice_1
set_property -dict {CONFIG.DIN_FROM 15 CONFIG.DIN_TO 8 CONFIG.DIN_WIDTH 16 CONFIG.DOUT_WIDTH 8} [get_bd_cells xlslice_1]
create_bd_cell -type ip -vlnv xilinx.com:ip:xlslice:1.0 xlslice_2
set_property -dict {CONFIG.DIN_FROM 0 CONFIG.DIN_TO 0 CONFIG.DIN_WIDTH 2 CONFIG.DOUT_WIDTH 1} [get_bd_cells xlslice_2]
create_bd_cell -type ip -vlnv xilinx.com:ip:xlslice:1.0 xlslice_3
set_property -dict {CONFIG.DIN_FROM 1 CONFIG.DIN_TO 1 CONFIG.DIN_WIDTH 2 CONFIG.DOUT_WIDTH 1} [get_bd_cells xlslice_3]
create_bd_cell -type ip -vlnv xilinx.com:ip:xlslice:1.0 xlslice_4
set_property -dict {CONFIG.DIN_FROM 0 CONFIG.DIN_TO 0 CONFIG.DIN_WIDTH 2 CONFIG.DOUT_WIDTH 1} [get_bd_cells xlslice_4]
create_bd_cell -type ip -vlnv xilinx.com:ip:xlslice:1.0 xlslice_5
set_property -dict {CONFIG.DIN_FROM 1 CONFIG.DIN_TO 1 CONFIG.DIN_WIDTH 2 CONFIG.DOUT_WIDTH 1} [get_bd_cells xlslice_5]
create_bd_cell -type ip -vlnv xilinx.com:ip:xlslice:1.0 xlslice_6
set_property -dict {CONFIG.DIN_FROM 0 CONFIG.DIN_TO 0 CONFIG.DIN_WIDTH 2 CONFIG.DOUT_WIDTH 1} [get_bd_cells xlslice_6]
create_bd_cell -type ip -vlnv xilinx.com:ip:xlslice:1.0 xlslice_7
set_property -dict {CONFIG.DIN_FROM 1 CONFIG.DIN_TO 1 CONFIG.DIN_WIDTH 2 CONFIG.DOUT_WIDTH 1} [get_bd_cells xlslice_7]
create_bd_cell -type ip -vlnv xilinx.com:ip:xlslice:1.0 xlslice_8
set_property -dict {CONFIG.DIN_FROM 7 CONFIG.DIN_TO 0 CONFIG.DIN_WIDTH 16 CONFIG.DOUT_WIDTH 8} [get_bd_cells xlslice_8]
create_bd_cell -type ip -vlnv xilinx.com:ip:xlslice:1.0 xlslice_9
set_property -dict {CONFIG.DIN_FROM 15 CONFIG.DIN_TO 8 CONFIG.DIN_WIDTH 16 CONFIG.DOUT_WIDTH 8} [get_bd_cells xlslice_9]
create_bd_cell -type ip -vlnv xilinx.com:ip:xlslice:1.0 xlslice_10
set_property -dict {CONFIG.DIN_FROM 0 CONFIG.DIN_TO 0 CONFIG.DIN_WIDTH 2 CONFIG.DOUT_WIDTH 1} [get_bd_cells xlslice_10]
create_bd_cell -type ip -vlnv xilinx.com:ip:xlslice:1.0 xlslice_11
set_property -dict {CONFIG.DIN_FROM 1 CONFIG.DIN_TO 1 CONFIG.DIN_WIDTH 2 CONFIG.DOUT_WIDTH 1} [get_bd_cells xlslice_11]
create_bd_cell -type ip -vlnv xilinx.com:ip:xlslice:1.0 xlslice_12
set_property -dict {CONFIG.DIN_FROM 0 CONFIG.DIN_TO 0 CONFIG.DIN_WIDTH 2 CONFIG.DOUT_WIDTH 1} [get_bd_cells xlslice_12]
create_bd_cell -type ip -vlnv xilinx.com:ip:xlslice:1.0 xlslice_13
set_property -dict {CONFIG.DIN_FROM 1 CONFIG.DIN_TO 1 CONFIG.DIN_WIDTH 2 CONFIG.DOUT_WIDTH 1} [get_bd_cells xlslice_13]
create_bd_cell -type ip -vlnv xilinx.com:ip:xlslice:1.0 xlslice_14
set_property -dict {CONFIG.DIN_FROM 0 CONFIG.DIN_TO 0 CONFIG.DIN_WIDTH 2 CONFIG.DOUT_WIDTH 1} [get_bd_cells xlslice_14]
create_bd_cell -type ip -vlnv xilinx.com:ip:xlslice:1.0 xlslice_15
set_property -dict {CONFIG.DIN_FROM 1 CONFIG.DIN_TO 1 CONFIG.DIN_WIDTH 2 CONFIG.DOUT_WIDTH 1} [get_bd_cells xlslice_15]
create_bd_cell -type ip -vlnv xilinx.com:ip:xlslice:1.0 xlslice_16
set_property -dict {CONFIG.DIN_FROM 0 CONFIG.DIN_TO 0 CONFIG.DIN_WIDTH 2} [get_bd_cells xlslice_16]
create_bd_cell -type ip -vlnv xilinx.com:ip:xlslice:1.0 xlslice_17
set_property -dict {CONFIG.DIN_FROM 1 CONFIG.DIN_TO 1 CONFIG.DIN_WIDTH 2 CONFIG.DOUT_WIDTH 1} [get_bd_cells xlslice_17]
create_bd_cell -type ip -vlnv xilinx.com:ip:xlslice:1.0 xlslice_18
set_property -dict {CONFIG.DIN_FROM 0 CONFIG.DIN_TO 0 CONFIG.DIN_WIDTH 2 CONFIG.DOUT_WIDTH 1} [get_bd_cells xlslice_18]
create_bd_cell -type ip -vlnv xilinx.com:ip:xlslice:1.0 xlslice_19
set_property -dict {CONFIG.DIN_FROM 1 CONFIG.DIN_TO 1 CONFIG.DIN_WIDTH 2 CONFIG.DOUT_WIDTH 1} [get_bd_cells xlslice_19]
create_bd_cell -type ip -vlnv xilinx.com:ip:xlslice:1.0 xlslice_20
set_property -dict {CONFIG.DIN_FROM 0 CONFIG.DIN_TO 0 CONFIG.DIN_WIDTH 2 CONFIG.DOUT_WIDTH 1} [get_bd_cells xlslice_20]
create_bd_cell -type ip -vlnv xilinx.com:ip:xlslice:1.0 xlslice_21
set_property -dict {CONFIG.DIN_FROM 1 CONFIG.DIN_TO 1 CONFIG.DIN_WIDTH 2 CONFIG.DOUT_WIDTH 1} [get_bd_cells xlslice_21]
create_bd_cell -type ip -vlnv xilinx.com:ip:xlslice:1.0 xlslice_22
set_property -dict {CONFIG.DIN_FROM 16 CONFIG.DIN_TO 0 CONFIG.DIN_WIDTH 18 CONFIG.DOUT_WIDTH 17} [get_bd_cells xlslice_22]
create_bd_cell -type ip -vlnv xilinx.com:ip:xlslice:1.0 xlslice_23
set_property -dict {CONFIG.DIN_FROM 15 CONFIG.DOUT_WIDTH 16} [get_bd_cells xlslice_23]
create_bd_cell -type ip -vlnv xilinx.com:ip:xlslice:1.0 xlslice_24
set_property -dict {CONFIG.DIN_FROM 31 CONFIG.DIN_TO 16 CONFIG.DOUT_WIDTH 16} [get_bd_cells xlslice_24]
create_bd_cell -type ip -vlnv xilinx.com:ip:xlslice:1.0 xlslice_25
set_property -dict {CONFIG.DIN_FROM 31 CONFIG.DIN_TO 0 CONFIG.DIN_WIDTH 512 CONFIG.DOUT_WIDTH 32} [get_bd_cells xlslice_25]
create_bd_cell -type ip -vlnv xilinx.com:ip:xlslice:1.0 xlslice_26
set_property -dict {CONFIG.DIN_FROM 31 CONFIG.DIN_TO 0 CONFIG.DIN_WIDTH 512 CONFIG.DOUT_WIDTH 32} [get_bd_cells xlslice_26]

# ---- connections ----

connect_bd_intf_net -intf_net s_axi_0_1 [get_bd_intf_ports s_axi] [get_bd_intf_pins tsn_endpoint_block_0/s_axi]
connect_bd_intf_net -intf_net tsn_endpoint_ethernet_mac_0_ptp_timers [get_bd_intf_ports ptp_timers] [get_bd_intf_pins tsn_endpoint_block_0/ptp_timers]
connect_bd_intf_net -intf_net tsn_endpoint_ethernet_mac_0_rx_axis_be [get_bd_intf_ports rx_axis_be] [get_bd_intf_pins tsn_endpoint_block_0/rx_axis_be]
connect_bd_intf_net -intf_net tsn_endpoint_ethernet_mac_0_rx_axis_st [get_bd_intf_ports rx_axis_st] [get_bd_intf_pins tsn_endpoint_block_0/rx_axis_st]
connect_bd_intf_net -intf_net tsn_temac_0_mdio_external [get_bd_intf_ports mdio_external1] [get_bd_intf_pins tsn_temac_1/mdio_external]
connect_bd_intf_net -intf_net tsn_temac_0_rgmii [get_bd_intf_ports rgmii1] [get_bd_intf_pins tsn_temac_1/rgmii]
connect_bd_intf_net -intf_net tsn_temac_0_rgmii_status [get_bd_intf_ports rgmii_status1] [get_bd_intf_pins tsn_temac_1/rgmii_status]
connect_bd_intf_net -intf_net tsn_temac_1_mdio_external [get_bd_intf_ports mdio_external2] [get_bd_intf_pins tsn_temac_2/mdio_external]
connect_bd_intf_net -intf_net tsn_temac_1_rgmii [get_bd_intf_ports rgmii2] [get_bd_intf_pins tsn_temac_2/rgmii]
connect_bd_intf_net -intf_net tsn_temac_1_rgmii_status [get_bd_intf_ports rgmii_status2] [get_bd_intf_pins tsn_temac_2/rgmii_status]
connect_bd_intf_net -intf_net tx_axis_be_0_1 [get_bd_intf_ports tx_axis_be] [get_bd_intf_pins tsn_endpoint_block_0/tx_axis_be]
connect_bd_intf_net -intf_net tx_axis_st_0_1 [get_bd_intf_ports tx_axis_st] [get_bd_intf_pins tsn_endpoint_block_0/tx_axis_st]
connect_bd_net [get_bd_pins tsn_endpoint_block_0/bus2ip_cs_mac2] [get_bd_pins tsn_temac_2/bus2ip_cs]
connect_bd_net -net glbl_rstn_0_1 [get_bd_ports glbl_rstn] \
  [get_bd_pins tsn_endpoint_block_0/glbl_rstn] [get_bd_pins tsn_temac_1/glbl_rstn] [get_bd_pins tsn_temac_2/glbl_rstn]
connect_bd_net -net gtx_clk_0_1 [get_bd_ports gtx_clk] \
  [get_bd_pins switch_core_top_0/CLK] [get_bd_pins tsn_endpoint_block_0/gtx_clk] [get_bd_pins tsn_temac_1/gtx_clk] \
  [get_bd_pins tsn_temac_2/gtx_clk]
connect_bd_net -net host_rxfifo_aclk_0_1 [get_bd_ports host_rxfifo_aclk] [get_bd_pins tsn_endpoint_block_0/host_rxfifo_aclk]
connect_bd_net -net host_txfifo_aclk_0_1 [get_bd_ports host_txfifo_aclk] [get_bd_pins tsn_endpoint_block_0/host_txfifo_aclk]
connect_bd_net -net refclk_0_1 [get_bd_ports refclk] [get_bd_pins tsn_endpoint_block_0/refclk] [get_bd_pins tsn_temac_1/refclk]
connect_bd_net -net s_axi_aclk_0_1 [get_bd_ports s_axi_aclk] [get_bd_pins tsn_endpoint_block_0/s_axi_aclk]
connect_bd_net -net s_axi_aresetn_0_1 [get_bd_ports s_axi_aresetn] [get_bd_pins tsn_endpoint_block_0/s_axi_aresetn]
connect_bd_net [get_bd_pins switch_core_top_0/INIT_DONE] [get_bd_ports INIT_DONE]
connect_bd_net [get_bd_pins switch_core_top_0/MACTX_EMAC_FRAME_LEN] [get_bd_pins tsn_endpoint_block_0/e_switch_mactx_frame_len]
connect_bd_net [get_bd_pins switch_core_top_0/MACTX_EMAC_GATE] [get_bd_pins tsn_endpoint_block_0/e_requesting_queue]
connect_bd_net [get_bd_pins switch_core_top_0/MACTX_EMAC_GATE_OVERRUN] [get_bd_pins tsn_endpoint_block_0/e_transmission_overrun_count_incr]
connect_bd_net [get_bd_pins switch_core_top_0/MACTX_EMAC_GATE_QACTIVE] [get_bd_pins tsn_endpoint_block_0/e_mactx_gate_qactive]
connect_bd_net [get_bd_pins switch_core_top_0/MACTX_EMAC_GATE_QSTATUS] [get_bd_pins tsn_endpoint_block_0/e_switch_gate_queue_status]
connect_bd_net [get_bd_pins switch_core_top_0/MACTX_EMAC_GATE_REQ] [get_bd_pins tsn_endpoint_block_0/e_requesting_queue_valid]
connect_bd_net [get_bd_pins switch_core_top_0/MACTX_FRAME_LEN] [get_bd_pins tsn_endpoint_block_0/switch_mactx_frame_len]
connect_bd_net [get_bd_pins switch_core_top_0/MACTX_GATE] [get_bd_pins tsn_endpoint_block_0/switch_requesting_queue]
connect_bd_net [get_bd_pins switch_core_top_0/MACTX_GATE_OVERRUN] [get_bd_pins tsn_endpoint_block_0/transmission_overrun_count_incr]
connect_bd_net [get_bd_pins switch_core_top_0/MACTX_GATE_QACTIVE] [get_bd_pins tsn_endpoint_block_0/mactx_gate_qactive]
connect_bd_net [get_bd_pins switch_core_top_0/MACTX_GATE_QSTATUS] [get_bd_pins tsn_endpoint_block_0/switch_gate_queue_status]
connect_bd_net [get_bd_pins switch_core_top_0/MACTX_GATE_REQ] [get_bd_pins tsn_endpoint_block_0/switch_requesting_queue_valid]
connect_bd_net [get_bd_pins switch_core_top_0/MACTX_PFC] [get_bd_pins tsn_endpoint_block_0/mactx_pfc]
connect_bd_net [get_bd_pins switch_core_top_0/MAX_FRAME_SIZE] [get_bd_pins tsn_endpoint_block_0/switch_max_frame_size]
connect_bd_net [get_bd_pins switch_core_top_0/PRIORITY_MAP] [get_bd_pins tsn_endpoint_block_0/switch_pfc_register_in]
connect_bd_net [get_bd_pins switch_core_top_0/S_AXIS_EMAC_TX_TDATA] [get_bd_pins tsn_endpoint_block_0/s_axis_emac_tx_tdata]
connect_bd_net [get_bd_pins switch_core_top_0/S_AXIS_EMAC_TX_TLAST] [get_bd_pins tsn_endpoint_block_0/s_axis_emac_tx_tlast]
connect_bd_net [get_bd_pins switch_core_top_0/S_AXIS_EMAC_TX_TUSER] [get_bd_pins tsn_endpoint_block_0/s_axis_emac_tx_tuser]
connect_bd_net [get_bd_pins switch_core_top_0/S_AXIS_EMAC_TX_TVALID] [get_bd_pins tsn_endpoint_block_0/s_axis_emac_tx_tvalid]
connect_bd_net [get_bd_pins switch_core_top_0/S_AXIS_TX_TDATA] [get_bd_pins tsn_endpoint_block_0/s_axis_tx_tdata]
connect_bd_net [get_bd_pins switch_core_top_0/S_AXIS_TX_TDATA_EP] [get_bd_pins tsn_endpoint_block_0/s_axis_tx_tdata_ep]
connect_bd_net [get_bd_pins switch_core_top_0/S_AXIS_TX_TDEST_EP] [get_bd_pins tsn_endpoint_block_0/s_axis_tx_tdest_ep]
connect_bd_net [get_bd_pins switch_core_top_0/S_AXIS_TX_TKEEP] [get_bd_pins tsn_endpoint_block_0/s_axis_tx_tkeep]
connect_bd_net [get_bd_pins switch_core_top_0/S_AXIS_TX_TKEEP_EP] [get_bd_pins tsn_endpoint_block_0/s_axis_tx_tkeep_ep]
connect_bd_net [get_bd_pins switch_core_top_0/S_AXIS_TX_TLAST] [get_bd_pins tsn_endpoint_block_0/s_axis_tx_tlast]
connect_bd_net [get_bd_pins switch_core_top_0/S_AXIS_TX_TLAST_EP] [get_bd_pins tsn_endpoint_block_0/s_axis_tx_tlast_ep]
connect_bd_net [get_bd_pins switch_core_top_0/S_AXIS_TX_TUSER] [get_bd_pins tsn_endpoint_block_0/s_axis_tx_tuser]
connect_bd_net [get_bd_pins switch_core_top_0/S_AXIS_TX_TUSER_EP] [get_bd_pins tsn_endpoint_block_0/s_axis_tx_tuser_ep]
connect_bd_net [get_bd_pins switch_core_top_0/S_AXIS_TX_TVALID] [get_bd_pins tsn_endpoint_block_0/s_axis_tx_tvalid]
connect_bd_net [get_bd_pins switch_core_top_0/S_AXIS_TX_TVALID_EP] [get_bd_pins tsn_endpoint_block_0/s_axis_tx_tvalid_ep]
connect_bd_net [get_bd_pins switch_core_top_0/S_AXI_ARREADY] [get_bd_pins tsn_endpoint_block_0/s_axi_switch_arready]
connect_bd_net [get_bd_pins switch_core_top_0/S_AXI_AWREADY] [get_bd_pins tsn_endpoint_block_0/s_axi_switch_awready]
connect_bd_net [get_bd_pins switch_core_top_0/S_AXI_BRESP] [get_bd_pins tsn_endpoint_block_0/s_axi_switch_bresp]
connect_bd_net [get_bd_pins switch_core_top_0/S_AXI_BVALID] [get_bd_pins tsn_endpoint_block_0/s_axi_switch_bvalid]
connect_bd_net [get_bd_pins switch_core_top_0/S_AXI_RDATA] [get_bd_pins tsn_endpoint_block_0/s_axi_switch_rdata]
connect_bd_net [get_bd_pins switch_core_top_0/S_AXI_RRESP] [get_bd_pins tsn_endpoint_block_0/s_axi_switch_rresp]
connect_bd_net [get_bd_pins switch_core_top_0/S_AXI_RVALID] [get_bd_pins tsn_endpoint_block_0/s_axi_switch_rvalid]
connect_bd_net [get_bd_pins switch_core_top_0/S_AXI_WREADY] [get_bd_pins tsn_endpoint_block_0/s_axi_switch_wready]
connect_bd_net [get_bd_pins tsn_endpoint_block_0/ep_tadma_if_out] [get_bd_ports ep_tadma_if_out]
connect_bd_net [get_bd_pins tsn_endpoint_block_0/rx_enable] [get_bd_ports misc_out_rx_enable]
connect_bd_net [get_bd_pins tsn_endpoint_block_0/rx_mac_aclk] [get_bd_ports misc_out_rx_mac_aclk]
connect_bd_net [get_bd_pins tsn_endpoint_block_0/rx_reset] [get_bd_ports misc_out_rx_reset]
connect_bd_net [get_bd_pins tsn_endpoint_block_0/speedis100] [get_bd_ports misc_out_speedis100]
connect_bd_net [get_bd_pins tsn_endpoint_block_0/switch_cam_init_done] [get_bd_ports misc_out_switch_cam_init_done]
connect_bd_net [get_bd_pins tsn_endpoint_block_0/tsn_debug_hooks] [get_bd_ports misc_out_tsn_debug_hooks]
connect_bd_net [get_bd_pins tsn_endpoint_block_0/tx_enable] [get_bd_ports misc_out_tx_enable]
connect_bd_net [get_bd_pins tsn_endpoint_block_0/tx_mac_aclk] [get_bd_ports misc_out_tx_mac_aclk]
connect_bd_net [get_bd_pins tsn_endpoint_block_0/tx_reset] [get_bd_ports misc_out_tx_reset]
connect_bd_net -net tsn_endpoint_ethernet_mac_0_bus2ip_addr [get_bd_pins tsn_endpoint_block_0/bus2ip_addr] [get_bd_pins xlslice_22/Din]
connect_bd_net -net tsn_endpoint_ethernet_mac_0_bus2ip_clk [get_bd_pins tsn_endpoint_block_0/bus2ip_clk] \
  [get_bd_pins switch_core_top_0/S_AXI_CLK] [get_bd_pins tsn_temac_1/bus2ip_clk] [get_bd_pins tsn_temac_2/bus2ip_clk]
connect_bd_net -net tsn_endpoint_ethernet_mac_0_bus2ip_cs_mac1 [get_bd_pins tsn_endpoint_block_0/bus2ip_cs_mac1] [get_bd_pins tsn_temac_1/bus2ip_cs]
connect_bd_net -net tsn_endpoint_ethernet_mac_0_bus2ip_data [get_bd_pins tsn_endpoint_block_0/bus2ip_data] \
  [get_bd_pins tsn_temac_1/bus2ip_data] [get_bd_pins tsn_temac_2/bus2ip_data]
connect_bd_net -net tsn_endpoint_ethernet_mac_0_bus2ip_rdce [get_bd_pins tsn_endpoint_block_0/bus2ip_rdce] \
  [get_bd_pins tsn_temac_1/bus2ip_rdce] [get_bd_pins tsn_temac_2/bus2ip_rdce]
connect_bd_net -net tsn_endpoint_ethernet_mac_0_bus2ip_reset [get_bd_pins tsn_endpoint_block_0/bus2ip_reset] \
  [get_bd_pins tsn_temac_1/bus2ip_reset] [get_bd_pins tsn_temac_2/bus2ip_reset]
connect_bd_net -net tsn_endpoint_ethernet_mac_0_bus2ip_wrce [get_bd_pins tsn_endpoint_block_0/bus2ip_wrce] \
  [get_bd_pins tsn_temac_1/bus2ip_wrce] [get_bd_pins tsn_temac_2/bus2ip_wrce]
connect_bd_net -net tsn_endpoint_ethernet_mac_0_core_hold_disabled_override_pmac [get_bd_pins tsn_endpoint_block_0/core_hold_disabled_override_pmac] \
  [get_bd_pins xlslice_16/Din] [get_bd_pins xlslice_17/Din]
connect_bd_net -net tsn_endpoint_ethernet_mac_0_e_current_gate_states_out_i [get_bd_pins tsn_endpoint_block_0/e_current_gate_states_out_i] \
  [get_bd_pins switch_core_top_0/MACTX_EMAC_GATE_STATE]
connect_bd_net -net tsn_endpoint_ethernet_mac_0_e_gate_masks_out [get_bd_pins tsn_endpoint_block_0/e_gate_masks_out] \
  [get_bd_pins switch_core_top_0/MACTX_EMAC_GATE_MASK]
connect_bd_net -net tsn_endpoint_ethernet_mac_0_e_guard_band_ack [get_bd_pins tsn_endpoint_block_0/e_guard_band_ack] \
  [get_bd_pins switch_core_top_0/MACTX_EMAC_GATE_ACK]
connect_bd_net -net tsn_endpoint_ethernet_mac_0_e_guard_band_nack [get_bd_pins tsn_endpoint_block_0/e_guard_band_nack] \
  [get_bd_pins switch_core_top_0/MACTX_EMAC_GATE_NAK]
connect_bd_net -net tsn_endpoint_ethernet_mac_0_gtx_clk_reset_reg [get_bd_pins tsn_endpoint_block_0/gtx_clk_reset_reg] \
  [get_bd_pins switch_core_top_0/RESET]
connect_bd_net -net tsn_endpoint_ethernet_mac_0_hold_request_pmac [get_bd_pins tsn_endpoint_block_0/hold_request_pmac] \
  [get_bd_pins xlslice_18/Din] [get_bd_pins xlslice_19/Din]
connect_bd_net -net tsn_endpoint_ethernet_mac_0_int_mgmt_host_reset_out_reg_n_switch [get_bd_pins tsn_endpoint_block_0/int_mgmt_host_reset_out_reg_n_switch] \
  [get_bd_pins switch_core_top_0/S_AXI_RESETN]
connect_bd_net -net tsn_endpoint_ethernet_mac_0_interrupt_ptp_rx_1 [get_bd_pins tsn_endpoint_block_0/interrupt_ptp_rx_1] \
  [get_bd_ports interrupt_ptp_rx_1]
connect_bd_net -net tsn_endpoint_ethernet_mac_0_interrupt_ptp_rx_2 [get_bd_pins tsn_endpoint_block_0/interrupt_ptp_rx_2] \
  [get_bd_ports interrupt_ptp_rx_2]
connect_bd_net -net tsn_endpoint_ethernet_mac_0_interrupt_ptp_tx_1 [get_bd_pins tsn_endpoint_block_0/interrupt_ptp_tx_1] \
  [get_bd_ports interrupt_ptp_tx_1]
connect_bd_net -net tsn_endpoint_ethernet_mac_0_interrupt_ptp_tx_2 [get_bd_pins tsn_endpoint_block_0/interrupt_ptp_tx_2] \
  [get_bd_ports interrupt_ptp_tx_2]
connect_bd_net -net tsn_endpoint_ethernet_mac_0_m_axis_rx_ctl [get_bd_pins tsn_endpoint_block_0/m_axis_rx_ctl] \
  [get_bd_pins switch_core_top_0/M_AXIS_RX_CTL]
connect_bd_net -net tsn_endpoint_ethernet_mac_0_m_axis_rx_tdata [get_bd_pins tsn_endpoint_block_0/m_axis_rx_tdata] \
  [get_bd_pins switch_core_top_0/M_AXIS_RX_TDATA]
connect_bd_net -net tsn_endpoint_ethernet_mac_0_m_axis_rx_tkeep [get_bd_pins tsn_endpoint_block_0/m_axis_rx_tkeep] \
  [get_bd_pins switch_core_top_0/M_AXIS_RX_TKEEP]
connect_bd_net -net tsn_endpoint_ethernet_mac_0_m_axis_rx_tlast [get_bd_pins tsn_endpoint_block_0/m_axis_rx_tlast] \
  [get_bd_pins switch_core_top_0/M_AXIS_RX_TLAST]
connect_bd_net -net tsn_endpoint_ethernet_mac_0_m_axis_rx_tuser [get_bd_pins tsn_endpoint_block_0/m_axis_rx_tuser] \
  [get_bd_pins switch_core_top_0/M_AXIS_RX_TUSER]
connect_bd_net -net tsn_endpoint_ethernet_mac_0_m_axis_rx_tvalid [get_bd_pins tsn_endpoint_block_0/m_axis_rx_tvalid] \
  [get_bd_pins switch_core_top_0/M_AXIS_RX_TVALID]
connect_bd_net -net tsn_endpoint_ethernet_mac_0_mac_irq_1 [get_bd_pins tsn_temac_1/mac_irq] [get_bd_ports mac_irq_1]
connect_bd_net -net tsn_endpoint_ethernet_mac_0_mac_irq_2 [get_bd_pins tsn_temac_2/mac_irq] [get_bd_ports mac_irq_2]
connect_bd_net -net tsn_endpoint_ethernet_mac_0_mac_rx_clk [get_bd_pins tsn_endpoint_block_0/mac_rx_clk] [get_bd_pins switch_core_top_0/MAC_RX_CLK]
connect_bd_net -net tsn_endpoint_ethernet_mac_0_mac_tx_clk [get_bd_pins tsn_endpoint_block_0/mac_tx_clk] [get_bd_pins switch_core_top_0/MAC_TX_CLK]
connect_bd_net -net tsn_endpoint_ethernet_mac_0_macrx_pfc [get_bd_pins tsn_endpoint_block_0/macrx_pfc] [get_bd_pins switch_core_top_0/MACRX_PFC]
connect_bd_net -net tsn_endpoint_ethernet_mac_0_ptp_current_time_sw [get_bd_pins tsn_endpoint_block_0/ptp_current_time_sw] \
  [get_bd_pins switch_core_top_0/PTP_CURRENT_TIME]
connect_bd_net -net tsn_endpoint_ethernet_mac_0_s_axi_switch_araddr_sw [get_bd_pins tsn_endpoint_block_0/s_axi_switch_araddr_sw] \
  [get_bd_pins switch_core_top_0/S_AXI_ARADDR]
connect_bd_net -net tsn_endpoint_ethernet_mac_0_s_axi_switch_arprot [get_bd_pins tsn_endpoint_block_0/s_axi_switch_arprot] \
  [get_bd_pins switch_core_top_0/S_AXI_ARPROT]
connect_bd_net -net tsn_endpoint_ethernet_mac_0_s_axi_switch_arvalid [get_bd_pins tsn_endpoint_block_0/s_axi_switch_arvalid] \
  [get_bd_pins switch_core_top_0/S_AXI_ARVALID]
connect_bd_net -net tsn_endpoint_ethernet_mac_0_s_axi_switch_awaddr_sw [get_bd_pins tsn_endpoint_block_0/s_axi_switch_awaddr_sw] \
  [get_bd_pins switch_core_top_0/S_AXI_AWADDR]
connect_bd_net -net tsn_endpoint_ethernet_mac_0_s_axi_switch_awprot [get_bd_pins tsn_endpoint_block_0/s_axi_switch_awprot] \
  [get_bd_pins switch_core_top_0/S_AXI_AWPROT]
connect_bd_net -net tsn_endpoint_ethernet_mac_0_s_axi_switch_awvalid [get_bd_pins tsn_endpoint_block_0/s_axi_switch_awvalid] \
  [get_bd_pins switch_core_top_0/S_AXI_AWVALID]
connect_bd_net -net tsn_endpoint_ethernet_mac_0_s_axi_switch_bready [get_bd_pins tsn_endpoint_block_0/s_axi_switch_bready] \
  [get_bd_pins switch_core_top_0/S_AXI_BREADY]
connect_bd_net -net tsn_endpoint_ethernet_mac_0_s_axi_switch_rready [get_bd_pins tsn_endpoint_block_0/s_axi_switch_rready] \
  [get_bd_pins switch_core_top_0/S_AXI_RREADY]
connect_bd_net -net tsn_endpoint_ethernet_mac_0_s_axi_switch_wdata [get_bd_pins tsn_endpoint_block_0/s_axi_switch_wdata] \
  [get_bd_pins switch_core_top_0/S_AXI_WDATA]
connect_bd_net -net tsn_endpoint_ethernet_mac_0_s_axi_switch_wstrb [get_bd_pins tsn_endpoint_block_0/s_axi_switch_wstrb] \
  [get_bd_pins switch_core_top_0/S_AXI_WSTRB]
connect_bd_net -net tsn_endpoint_ethernet_mac_0_s_axi_switch_wvalid [get_bd_pins tsn_endpoint_block_0/s_axi_switch_wvalid] \
  [get_bd_pins switch_core_top_0/S_AXI_WVALID]
connect_bd_net -net tsn_endpoint_ethernet_mac_0_s_axis_emac_tx_tready [get_bd_pins tsn_endpoint_block_0/s_axis_emac_tx_tready] \
  [get_bd_pins switch_core_top_0/S_AXIS_EMAC_TX_TREADY]
connect_bd_net -net tsn_endpoint_ethernet_mac_0_s_axis_tx_tready [get_bd_pins tsn_endpoint_block_0/s_axis_tx_tready] \
  [get_bd_pins switch_core_top_0/S_AXIS_TX_TREADY]
connect_bd_net -net tsn_endpoint_ethernet_mac_0_s_axis_tx_tready_ep [get_bd_pins tsn_endpoint_block_0/s_axis_tx_tready_ep] \
  [get_bd_pins switch_core_top_0/S_AXIS_TX_TREADY_EP]
connect_bd_net -net tsn_endpoint_ethernet_mac_0_switch_be_pkt_byte_count_sw [get_bd_pins tsn_endpoint_block_0/switch_be_pkt_byte_count_sw] \
  [get_bd_pins xlslice_23/Din] [get_bd_pins xlslice_24/Din]
connect_bd_net -net tsn_endpoint_ethernet_mac_0_switch_current_gate_states_out_i2 [get_bd_pins tsn_endpoint_block_0/switch_current_gate_states_out_i2] \
  [get_bd_pins switch_core_top_0/MACTX_GATE_STATE]
connect_bd_net -net tsn_endpoint_ethernet_mac_0_switch_gate_masks_out_i [get_bd_pins tsn_endpoint_block_0/switch_gate_masks_out_i] \
  [get_bd_pins switch_core_top_0/MACTX_GATE_MASK]
connect_bd_net -net tsn_endpoint_ethernet_mac_0_switch_guard_band_ack [get_bd_pins tsn_endpoint_block_0/switch_guard_band_ack] \
  [get_bd_pins switch_core_top_0/MACTX_GATE_ACK]
connect_bd_net -net tsn_endpoint_ethernet_mac_0_switch_guard_band_nack [get_bd_pins tsn_endpoint_block_0/switch_guard_band_nack] \
  [get_bd_pins switch_core_top_0/MACTX_GATE_NAK]
connect_bd_net -net tsn_endpoint_ethernet_mac_0_tsn_ep_scheduler_irq [get_bd_pins tsn_endpoint_block_0/tsn_ep_scheduler_irq] \
  [get_bd_ports tsn_ep_scheduler_irq]
connect_bd_net -net tsn_endpoint_ethernet_mac_0_tsn_switch_scheduler_irq_1 [get_bd_pins tsn_endpoint_block_0/tsn_switch_scheduler_irq_1] \
  [get_bd_ports tsn_switch_scheduler_irq_1]
connect_bd_net -net tsn_endpoint_ethernet_mac_0_tsn_switch_scheduler_irq_2 [get_bd_pins tsn_endpoint_block_0/tsn_switch_scheduler_irq_2] \
  [get_bd_ports tsn_switch_scheduler_irq_2]
connect_bd_net -net tsn_endpoint_ethernet_mac_0_tx_axis_mac_tdata [get_bd_pins tsn_endpoint_block_0/tx_axis_mac_tdata] \
  [get_bd_pins xlslice_8/Din] [get_bd_pins xlslice_9/Din]
connect_bd_net -net tsn_endpoint_ethernet_mac_0_tx_axis_mac_tlast [get_bd_pins tsn_endpoint_block_0/tx_axis_mac_tlast] \
  [get_bd_pins xlslice_10/Din] [get_bd_pins xlslice_11/Din]
connect_bd_net -net tsn_endpoint_ethernet_mac_0_tx_axis_mac_tuser [get_bd_pins tsn_endpoint_block_0/tx_axis_mac_tuser] \
  [get_bd_pins xlslice_12/Din] [get_bd_pins xlslice_13/Din]
connect_bd_net -net tsn_endpoint_ethernet_mac_0_tx_axis_mac_tvalid [get_bd_pins tsn_endpoint_block_0/tx_axis_mac_tvalid] \
  [get_bd_pins xlslice_14/Din] [get_bd_pins xlslice_15/Din]
connect_bd_net -net tsn_endpoint_ethernet_mac_0_tx_axis_pmac_tdata [get_bd_pins tsn_endpoint_block_0/tx_axis_pmac_tdata] \
  [get_bd_pins xlslice_0/Din] [get_bd_pins xlslice_1/Din]
connect_bd_net -net tsn_endpoint_ethernet_mac_0_tx_axis_pmac_tlast [get_bd_pins tsn_endpoint_block_0/tx_axis_pmac_tlast] \
  [get_bd_pins xlslice_2/Din] [get_bd_pins xlslice_3/Din]
connect_bd_net -net tsn_endpoint_ethernet_mac_0_tx_axis_pmac_tuser [get_bd_pins tsn_endpoint_block_0/tx_axis_pmac_tuser] \
  [get_bd_pins xlslice_4/Din] [get_bd_pins xlslice_5/Din]
connect_bd_net -net tsn_endpoint_ethernet_mac_0_tx_axis_pmac_tvalid [get_bd_pins tsn_endpoint_block_0/tx_axis_pmac_tvalid] \
  [get_bd_pins xlslice_6/Din] [get_bd_pins xlslice_7/Din]
connect_bd_net -net tsn_endpoint_ethernet_mac_0_tx_ptp_frame_allowed [get_bd_pins tsn_endpoint_block_0/tx_ptp_frame_allowed] \
  [get_bd_pins xlslice_20/Din] [get_bd_pins xlslice_21/Din]
connect_bd_net -net tsn_temac_0_clk8k [get_bd_pins tsn_temac_1/clk8k] [get_bd_pins tsn_endpoint_block_0/clk8k_in]
connect_bd_net -net tsn_temac_0_int_mgmt_host_reset_out [get_bd_pins tsn_temac_1/int_mgmt_host_reset_out] \
  [get_bd_pins tsn_endpoint_block_0/int_mgmt_host_reset_out]
connect_bd_net -net tsn_temac_0_ip2bus_data [get_bd_pins tsn_temac_1/ip2bus_data] [get_bd_pins tsn_endpoint_block_0/ip2bus_data_mac1]
connect_bd_net -net tsn_temac_0_ip2bus_error [get_bd_pins tsn_temac_1/ip2bus_error] [get_bd_pins tsn_endpoint_block_0/ip2bus_error_mac1]
connect_bd_net -net tsn_temac_0_ip2bus_rdack [get_bd_pins tsn_temac_1/ip2bus_rdack] [get_bd_pins tsn_endpoint_block_0/ip2bus_rdack_mac1]
connect_bd_net -net tsn_temac_0_ip2bus_wrack [get_bd_pins tsn_temac_1/ip2bus_wrack] [get_bd_pins tsn_endpoint_block_0/ip2bus_wrack_mac1]
connect_bd_net -net tsn_temac_0_preemption_signal_vector [get_bd_pins tsn_temac_1/preemption_signal_vector] [get_bd_pins xlconcat_20/In0]
connect_bd_net -net tsn_temac_0_rtc_nanosec_field [get_bd_pins tsn_temac_1/rtc_nanosec_field] \
  [get_bd_pins tsn_endpoint_block_0/rtc_nanosec_field_in] [get_bd_pins tsn_temac_2/rtc_nanosec_field_in]
connect_bd_net -net tsn_temac_0_rtc_nanosec_field_1722 [get_bd_pins tsn_temac_1/rtc_nanosec_field_1722] \
  [get_bd_pins tsn_endpoint_block_0/rtc_nanosec_field_1722_in]
connect_bd_net -net tsn_temac_0_rtc_sec_field [get_bd_pins tsn_temac_1/rtc_sec_field] \
  [get_bd_pins tsn_endpoint_block_0/rtc_sec_field_in] [get_bd_pins tsn_temac_2/rtc_sec_field_in]
connect_bd_net -net tsn_temac_0_rx_axis_av_filter_tuser [get_bd_pins tsn_temac_1/rx_axis_av_filter_tuser] \
  [get_bd_pins tsn_endpoint_block_0/rx_axis_av_filter_tuser]
connect_bd_net -net tsn_temac_0_rx_axis_mac_tdata [get_bd_pins tsn_temac_1/rx_axis_mac_tdata] [get_bd_pins xlconcat_6/In0]
connect_bd_net -net tsn_temac_0_rx_axis_mac_tlast [get_bd_pins tsn_temac_1/rx_axis_mac_tlast] [get_bd_pins xlconcat_7/In0]
connect_bd_net -net tsn_temac_0_rx_axis_mac_tuser [get_bd_pins tsn_temac_1/rx_axis_mac_tuser] [get_bd_pins xlconcat_8/In0]
connect_bd_net -net tsn_temac_0_rx_axis_mac_tvalid [get_bd_pins tsn_temac_1/rx_axis_mac_tvalid] [get_bd_pins xlconcat_9/In0]
connect_bd_net -net tsn_temac_0_rx_axis_pmac_av_filter_tuser [get_bd_pins tsn_temac_1/rx_axis_pmac_av_filter_tuser] \
  [get_bd_pins tsn_endpoint_block_0/rx_axis_pmac_av_filter_tuser]
connect_bd_net -net tsn_temac_0_rx_axis_pmac_st_filter_tuser [get_bd_pins tsn_temac_1/rx_axis_pmac_st_filter_tuser] \
  [get_bd_pins tsn_endpoint_block_0/rx_axis_pmac_st_filter_tuser]
connect_bd_net -net tsn_temac_0_rx_axis_pmac_tdata [get_bd_pins tsn_temac_1/rx_axis_pmac_tdata] [get_bd_pins xlconcat_1/In0]
connect_bd_net -net tsn_temac_0_rx_axis_pmac_tlast [get_bd_pins tsn_temac_1/rx_axis_pmac_tlast] [get_bd_pins xlconcat_2/In0]
connect_bd_net -net tsn_temac_0_rx_axis_pmac_tuser [get_bd_pins tsn_temac_1/rx_axis_pmac_tuser] [get_bd_pins xlconcat_3/In0]
connect_bd_net -net tsn_temac_0_rx_axis_pmac_tvalid [get_bd_pins tsn_temac_1/rx_axis_pmac_tvalid] [get_bd_pins xlconcat_4/In0]
connect_bd_net -net tsn_temac_0_rx_axis_st_filter_tuser [get_bd_pins tsn_temac_1/rx_axis_st_filter_tuser] \
  [get_bd_pins tsn_endpoint_block_0/rx_axis_st_filter_tuser]
connect_bd_net -net tsn_temac_0_rx_enable [get_bd_pins tsn_temac_1/rx_enable] [get_bd_pins xlconcat_12/In0]
connect_bd_net -net tsn_temac_0_rx_mac_aclk [get_bd_pins tsn_temac_1/rx_mac_aclk] [get_bd_pins xlconcat_10/In0]
connect_bd_net -net tsn_temac_0_rx_reset [get_bd_pins tsn_temac_1/rx_reset] [get_bd_pins xlconcat_19/In0]
connect_bd_net -net tsn_temac_0_speedis100 [get_bd_pins tsn_temac_1/speedis100] [get_bd_pins xlconcat_14/In0]
connect_bd_net -net tsn_temac_0_syntonised_nanosec_field [get_bd_pins tsn_temac_1/syntonised_nanosec_field] \
  [get_bd_pins tsn_endpoint_block_0/syntonised_nanosec_field_in] [get_bd_pins tsn_temac_2/syntonised_nanosec_field_in]
connect_bd_net -net tsn_temac_0_syntonised_sec_field [get_bd_pins tsn_temac_1/syntonised_sec_field] \
  [get_bd_pins tsn_endpoint_block_0/syntonised_sec_field_in] [get_bd_pins tsn_temac_2/syntonised_sec_field_in]
connect_bd_net -net tsn_temac_0_tx_axis_mac_tready [get_bd_pins tsn_temac_1/tx_axis_mac_tready] [get_bd_pins xlconcat_5/In0]
connect_bd_net -net tsn_temac_0_tx_axis_pmac_tready [get_bd_pins tsn_temac_1/tx_axis_pmac_tready] [get_bd_pins xlconcat_0/In0]
connect_bd_net -net tsn_temac_0_tx_enable [get_bd_pins tsn_temac_1/tx_enable] [get_bd_pins xlconcat_13/In0]
connect_bd_net -net tsn_temac_0_tx_mac_aclk [get_bd_pins tsn_temac_1/tx_mac_aclk] [get_bd_pins xlconcat_11/In0]
connect_bd_net -net tsn_temac_0_tx_ptp_frame_available [get_bd_pins tsn_temac_1/tx_ptp_frame_available] [get_bd_pins xlconcat_15/In0]
connect_bd_net -net tsn_temac_0_tx_ptp_frame_granted_for_transmission [get_bd_pins tsn_temac_1/tx_ptp_frame_granted_for_transmission] \
  [get_bd_pins xlconcat_16/In0]
connect_bd_net -net tsn_temac_0_tx_reset [get_bd_pins tsn_temac_1/tx_reset] [get_bd_pins xlconcat_18/In0]
connect_bd_net -net tsn_temac_0_tx_scheduler_internal_overhead_tsn [get_bd_pins tsn_temac_1/tx_scheduler_internal_overhead_tsn] \
  [get_bd_pins xlconcat_17/In0]
connect_bd_net [get_bd_pins tsn_temac_1/interrupt_ptp_rx] [get_bd_pins xlconcat_24/In0]
connect_bd_net [get_bd_pins tsn_temac_1/interrupt_ptp_timer] [get_bd_ports interrupt_ptp_timer]
connect_bd_net [get_bd_pins tsn_temac_1/interrupt_ptp_tx] [get_bd_pins xlconcat_25/In0]
connect_bd_net -net tsn_temac_1_ip2bus_data [get_bd_pins tsn_temac_2/ip2bus_data] [get_bd_pins tsn_endpoint_block_0/ip2bus_data_mac2]
connect_bd_net -net tsn_temac_1_ip2bus_error [get_bd_pins tsn_temac_2/ip2bus_error] [get_bd_pins tsn_endpoint_block_0/ip2bus_error_mac2]
connect_bd_net -net tsn_temac_1_ip2bus_rdack [get_bd_pins tsn_temac_2/ip2bus_rdack] [get_bd_pins tsn_endpoint_block_0/ip2bus_rdack_mac2]
connect_bd_net -net tsn_temac_1_ip2bus_wrack [get_bd_pins tsn_temac_2/ip2bus_wrack] [get_bd_pins tsn_endpoint_block_0/ip2bus_wrack_mac2]
connect_bd_net [get_bd_pins tsn_temac_1/mac_debug_out] [get_bd_pins xlslice_25/Din]
connect_bd_net -net tsn_temac_1_preemption_signal_vector [get_bd_pins tsn_temac_2/preemption_signal_vector] [get_bd_pins xlconcat_20/In1]
connect_bd_net -net tsn_temac_1_rx_axis_mac_tdata [get_bd_pins tsn_temac_2/rx_axis_mac_tdata] [get_bd_pins xlconcat_6/In1]
connect_bd_net -net tsn_temac_1_rx_axis_mac_tlast [get_bd_pins tsn_temac_2/rx_axis_mac_tlast] [get_bd_pins xlconcat_7/In1]
connect_bd_net -net tsn_temac_1_rx_axis_mac_tuser [get_bd_pins tsn_temac_2/rx_axis_mac_tuser] [get_bd_pins xlconcat_8/In1]
connect_bd_net -net tsn_temac_1_rx_axis_mac_tvalid [get_bd_pins tsn_temac_2/rx_axis_mac_tvalid] [get_bd_pins xlconcat_9/In1]
connect_bd_net -net tsn_temac_1_rx_axis_pmac_tdata [get_bd_pins tsn_temac_2/rx_axis_pmac_tdata] [get_bd_pins xlconcat_1/In1]
connect_bd_net -net tsn_temac_1_rx_axis_pmac_tlast [get_bd_pins tsn_temac_2/rx_axis_pmac_tlast] [get_bd_pins xlconcat_2/In1]
connect_bd_net -net tsn_temac_1_rx_axis_pmac_tuser [get_bd_pins tsn_temac_2/rx_axis_pmac_tuser] [get_bd_pins xlconcat_3/In1]
connect_bd_net -net tsn_temac_1_rx_axis_pmac_tvalid [get_bd_pins tsn_temac_2/rx_axis_pmac_tvalid] [get_bd_pins xlconcat_4/In1]
connect_bd_net -net tsn_temac_1_rx_enable [get_bd_pins tsn_temac_2/rx_enable] [get_bd_pins xlconcat_12/In1]
connect_bd_net -net tsn_temac_1_rx_mac_aclk [get_bd_pins tsn_temac_2/rx_mac_aclk] [get_bd_pins xlconcat_10/In1]
connect_bd_net -net tsn_temac_1_rx_reset [get_bd_pins tsn_temac_2/rx_reset] [get_bd_pins xlconcat_19/In1]
connect_bd_net [get_bd_pins tsn_temac_1/rx_statistics_valid] [get_bd_ports temac_misc_out1_rx_statistics_valid]
connect_bd_net [get_bd_pins tsn_temac_1/rx_statistics_valid_pmac] [get_bd_ports temac_misc_out1_rx_statistics_valid_pmac]
connect_bd_net [get_bd_pins tsn_temac_1/rx_statistics_vector] [get_bd_ports temac_misc_out1_rx_statistics_vector]
connect_bd_net [get_bd_pins tsn_temac_1/rx_statistics_vector_pmac] [get_bd_ports temac_misc_out1_rx_statistics_vector_pmac]
connect_bd_net [get_bd_pins tsn_temac_1/rx_ts_axis_tdata] [get_bd_ports temac_misc_out1_rx_ts_axis_tdata]
